# EAGLE design CANTensegrityBoard (EAGLE 6.4)

## Sheet 1 of 6
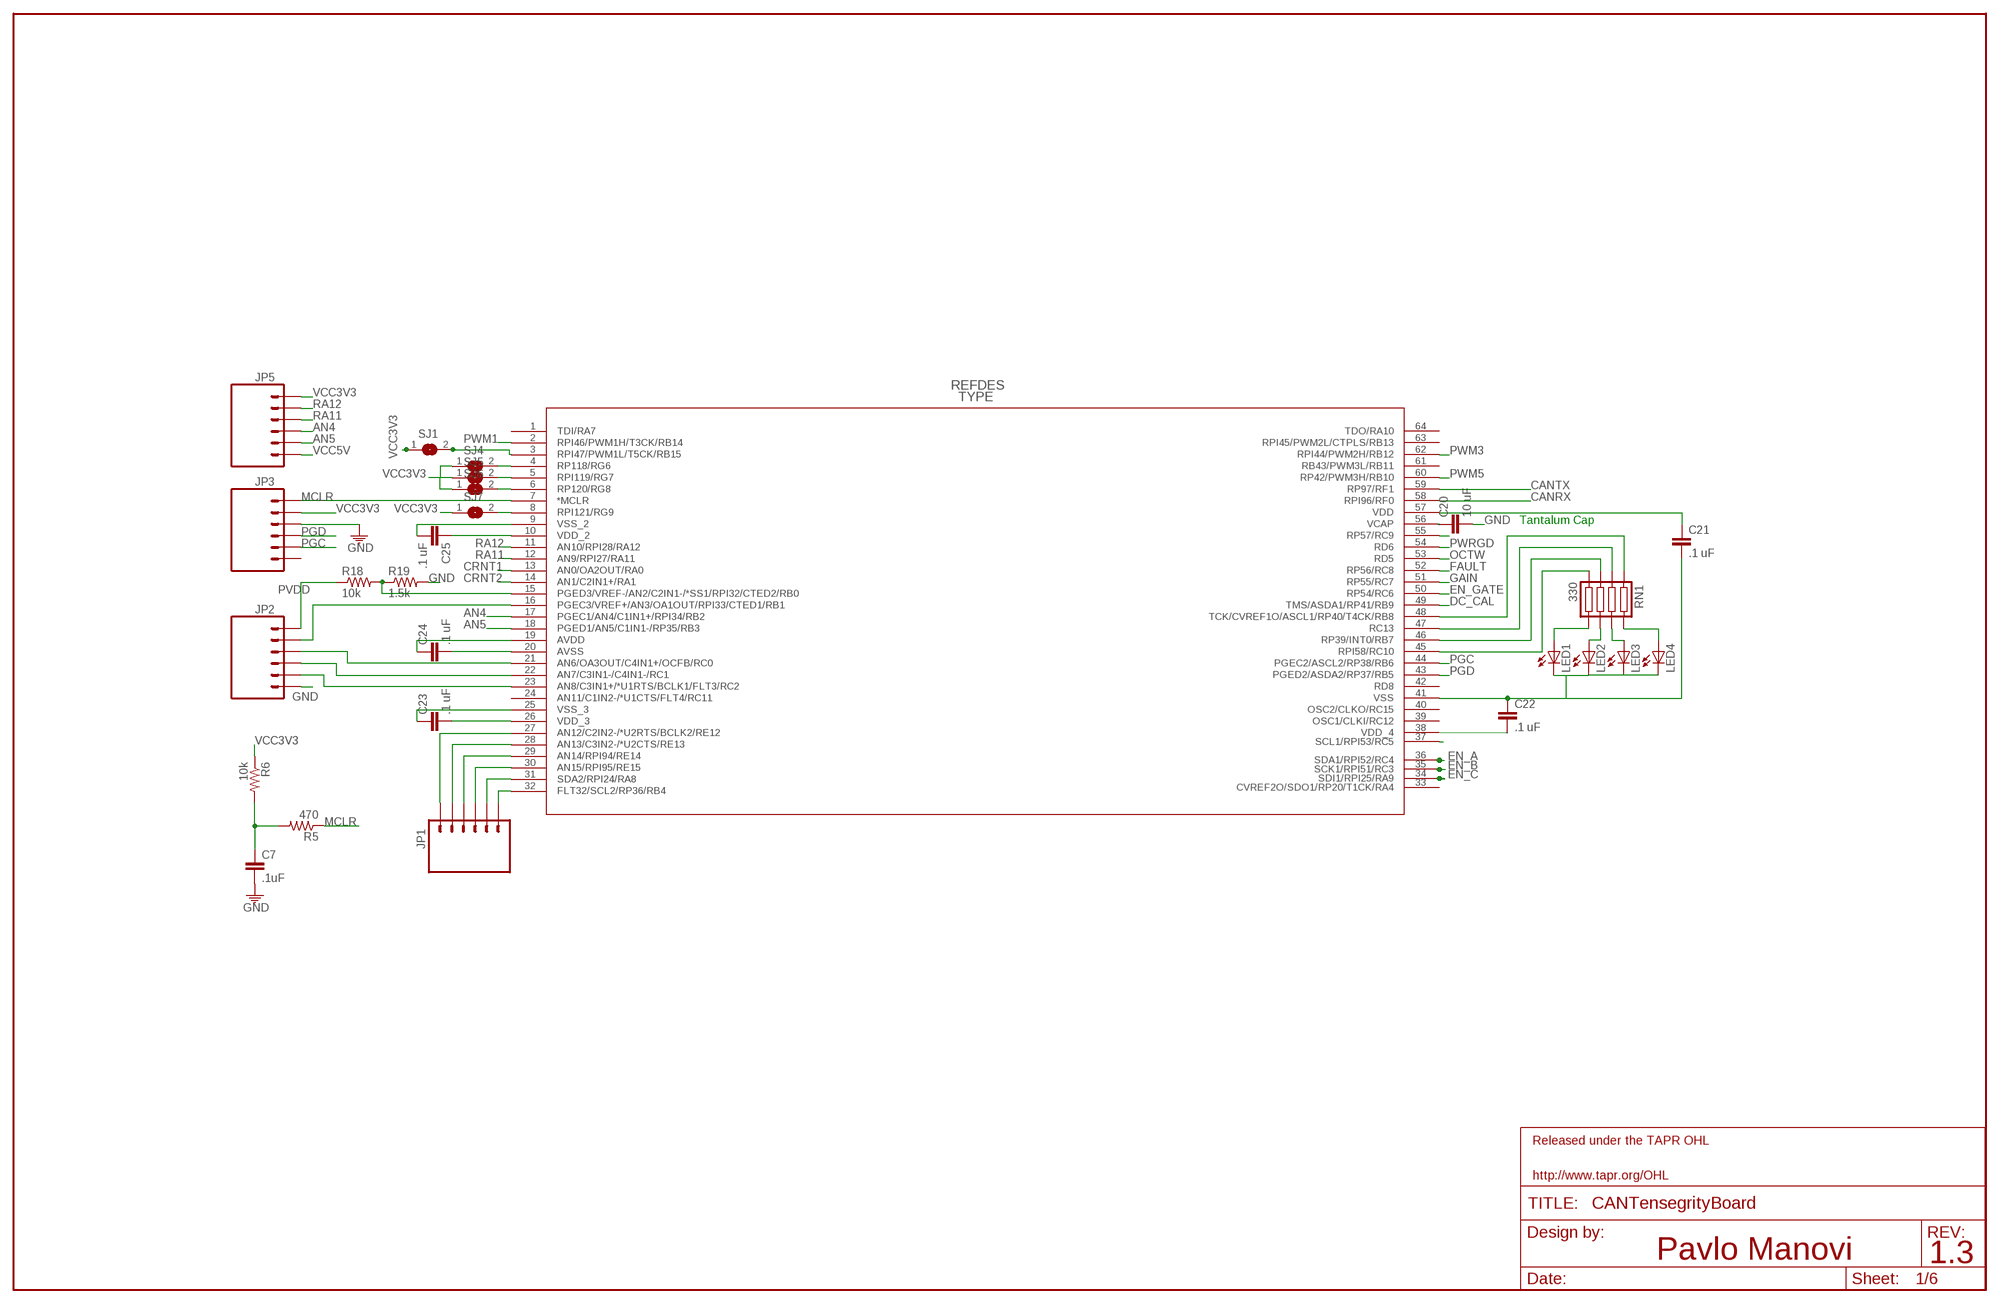
[diagram p0: schematic, sheet 1]

### Parts
C7  .1uF  CAP0805  [0805]
C20  10 uF  CAP1206  [1206]
C21  .1 uF  CAP0805  [0805]
C22  .1 uF  CAP0805  [0805]
C23  .1 uF  CAP0805  [0805]
C24  .1 uF  CAP0805  [0805]
C25  .1 uF  CAP0805  [0805]
JP1  M06SIP  [1X06]
JP2  M06SIP  [1X06]
JP3  M06LOCK  [1X06_LOCK]
JP5  M06LOCK  [1X06_LOCK]
LED1  LED0805  [LED-0805]
LED2  LED0805  [LED-0805]
LED3  LED0805  [LED-0805]
LED4  LED0805  [LED-0805]
R5  470  RESISTOR0805-RES  [0805]
R6  10k  RESISTOR0805-RES  [0805]
R18  10k  RESISTOR0805-RES  [0805]
R19  1.5k  RESISTOR0805-RES  [0805]
RN1  330  RESISTOR_ARRAY-4  [EXB-38V271JV]
SJ1  SJ  [SJ]
SJ4  SJ  [SJ]
SJ5  SJ  [SJ]
SJ6  SJ  [SJ]
SJ7  SJ  [SJ]
U$1  DSPIC33EP128MC502-I/SS  DSPIC33EP256MC50  [QFP64-10X10MC]

### Nets
AN4: JP5.4 U$1.17(PGEC1/AN4/C1IN1+/RPI34/RB2)
AN5: JP5.5 U$1.18(PGED1/AN5/C1IN1-/RP35/RB3)
CANRX: U$1.58(RPI96/RF0) ; also sheet 4
CANTX: U$1.59(RP97/RF1) ; also sheet 4
CRNT1: U$1.13(AN0/OA2OUT/RA0) ; also sheet 2
CRNT2: U$1.14(AN1/C2IN1+/RA1) ; also sheet 2
DC_CAL: U$1.49(TMS/ASDA1/RP41/RB9) ; also sheet 2
EN_A: U$1.36(SDA1/RPI52/RC4) ; also sheet 6
EN_B: U$1.35(SCK1/RPI51/RC3) ; also sheet 6
EN_C: U$1.34(SDI1/RPI25/RA9) ; also sheet 6
EN_GATE: U$1.50(RP54/RC6) ; also sheet 2
FAULT: U$1.52(RP56/RC8) ; also sheet 2
GAIN: U$1.51(RP55/RC7) ; also sheet 2
GND [Power]: C7.2 C20.2 C21.2 C22.1 JP2.6 JP3.3 LED1.2(C) LED2.2(C) LED3.2(C) LED4.2(C) R19.2 U$1.41(VSS) ; also sheet 2,3,4,5,6
MCLR: JP3.1 R5.1 U$1.7(*MCLR)
N$2: C7.1 R5.2 R6.2
N$11: SJ1.2 U$1.3(RPI47/PWM1L/T5CK/RB15)
N$25: R18.2 R19.1 U$1.15(PGED3/VREF-/AN2/C2IN1-/*SS1/RPI32/CTED2/RB0)
N$26: U$1.37(SCL1/RPI53/RC5)
N$27: SJ4.2 U$1.4(RP118/RG6)
N$28: SJ5.2 U$1.5(RPI119/RG7)
N$29: SJ6.2 U$1.6(RP120/RG8)
N$30: SJ7.2 U$1.8(RPI121/RG9)
N$31: C20.1 U$1.56(VCAP)
N$32: C21.1 U$1.57(VDD)
N$33: RN1.P$1 U$1.48(TCK/CVREF1O/ASCL1/RP40/T4CK/RB8)
N$34: C22.2 U$1.38(VDD_4)
N$35: C25.1 U$1.10(VDD_2)
N$36: C25.2 U$1.9(VSS_2)
N$37: C24.2 U$1.20(AVSS)
N$38: C24.1 U$1.19(AVDD)
N$39: C23.2 U$1.26(VDD_3)
N$40: C23.1 U$1.25(VSS_3)
N$41: RN1.P$2 U$1.47(RC13)
N$42: RN1.P$3 U$1.46(RP39/INT0/RB7)
N$43: RN1.P$4 U$1.45(RPI58/RC10)
N$44: LED1.1(A) RN1.P$5
N$45: LED2.1(A) RN1.P$6
N$46: LED3.1(A) RN1.P$7
N$47: LED4.1(A) RN1.P$8
N$48: JP1.6 U$1.32(FLT32/SCL2/RP36/RB4)
N$49: JP1.5 U$1.31(SDA2/RPI24/RA8)
N$50: JP1.4 U$1.30(AN15/RPI95/RE15)
N$51: JP1.3 U$1.29(AN14/RPI94/RE14)
N$52: JP1.2 U$1.28(AN13/C3IN2-/*U2CTS/RE13)
N$53: JP1.1 U$1.27(AN12/C2IN2-/*U2RTS/BCLK2/RE12)
N$55: JP2.2 U$1.16(PGEC3/VREF+/AN3/OA1OUT/RPI33/CTED1/RB1)
N$56: JP2.3 U$1.21(AN6/OA3OUT/C4IN1+/OCFB/RC0)
N$57: JP2.4 U$1.22(AN7/C3IN1-/C4IN1-/RC1)
N$58: JP2.5 U$1.23(AN8/C3IN1+/*U1RTS/BCLK1/FLT3/RC2)
OCTW: U$1.53(RD5) ; also sheet 2
PGC: JP3.5 U$1.44(PGEC2/ASCL2/RP38/RB6)
PGD [small]: JP3.4 U$1.43(PGED2/ASDA2/RP37/RB5)
PVDD [Power]: JP2.1 R18.1 ; also sheet 2,3
PWM1: U$1.2(RPI46/PWM1H/T3CK/RB14) ; also sheet 2
PWM3: U$1.62(RPI44/PWM2H/RB12) ; also sheet 2
PWM5: U$1.60(RP42/PWM3H/RB10) ; also sheet 2
PWRGD: U$1.54(RD6) ; also sheet 2
RA11: JP5.3 U$1.12(AN9/RPI27/RA11)
RA12: JP5.2 U$1.11(AN10/RPI28/RA12)
RC9: U$1.55(RP57/RC9)
VCC3V3 [Power]: JP3.2 JP5.1 R6.1 SJ1.1 SJ4.1 SJ5.1 SJ6.1 SJ7.1 ; also sheet 2,4,5,6
VCC5V: JP5.6 ; also sheet 5
Unconnected: JP3.6 U$1.1(TDI/RA7) U$1.24(AN11/C1IN2-/*U1CTS/FLT4/RC11) U$1.33(CVREF2O/SDO1/RP20/T1CK/RA4) U$1.39(OSC1/CLKI/RC12) U$1.40(OSC2/CLKO/RC15) U$1.42(RD8) U$1.61(RB43/PWM3L/RB11) U$1.63(RPI45/PWM2L/CTPLS/RB13) U$1.64(TDO/RA10)

### Notes on the sheet
- Tantalum Cap

## Sheet 2 of 6
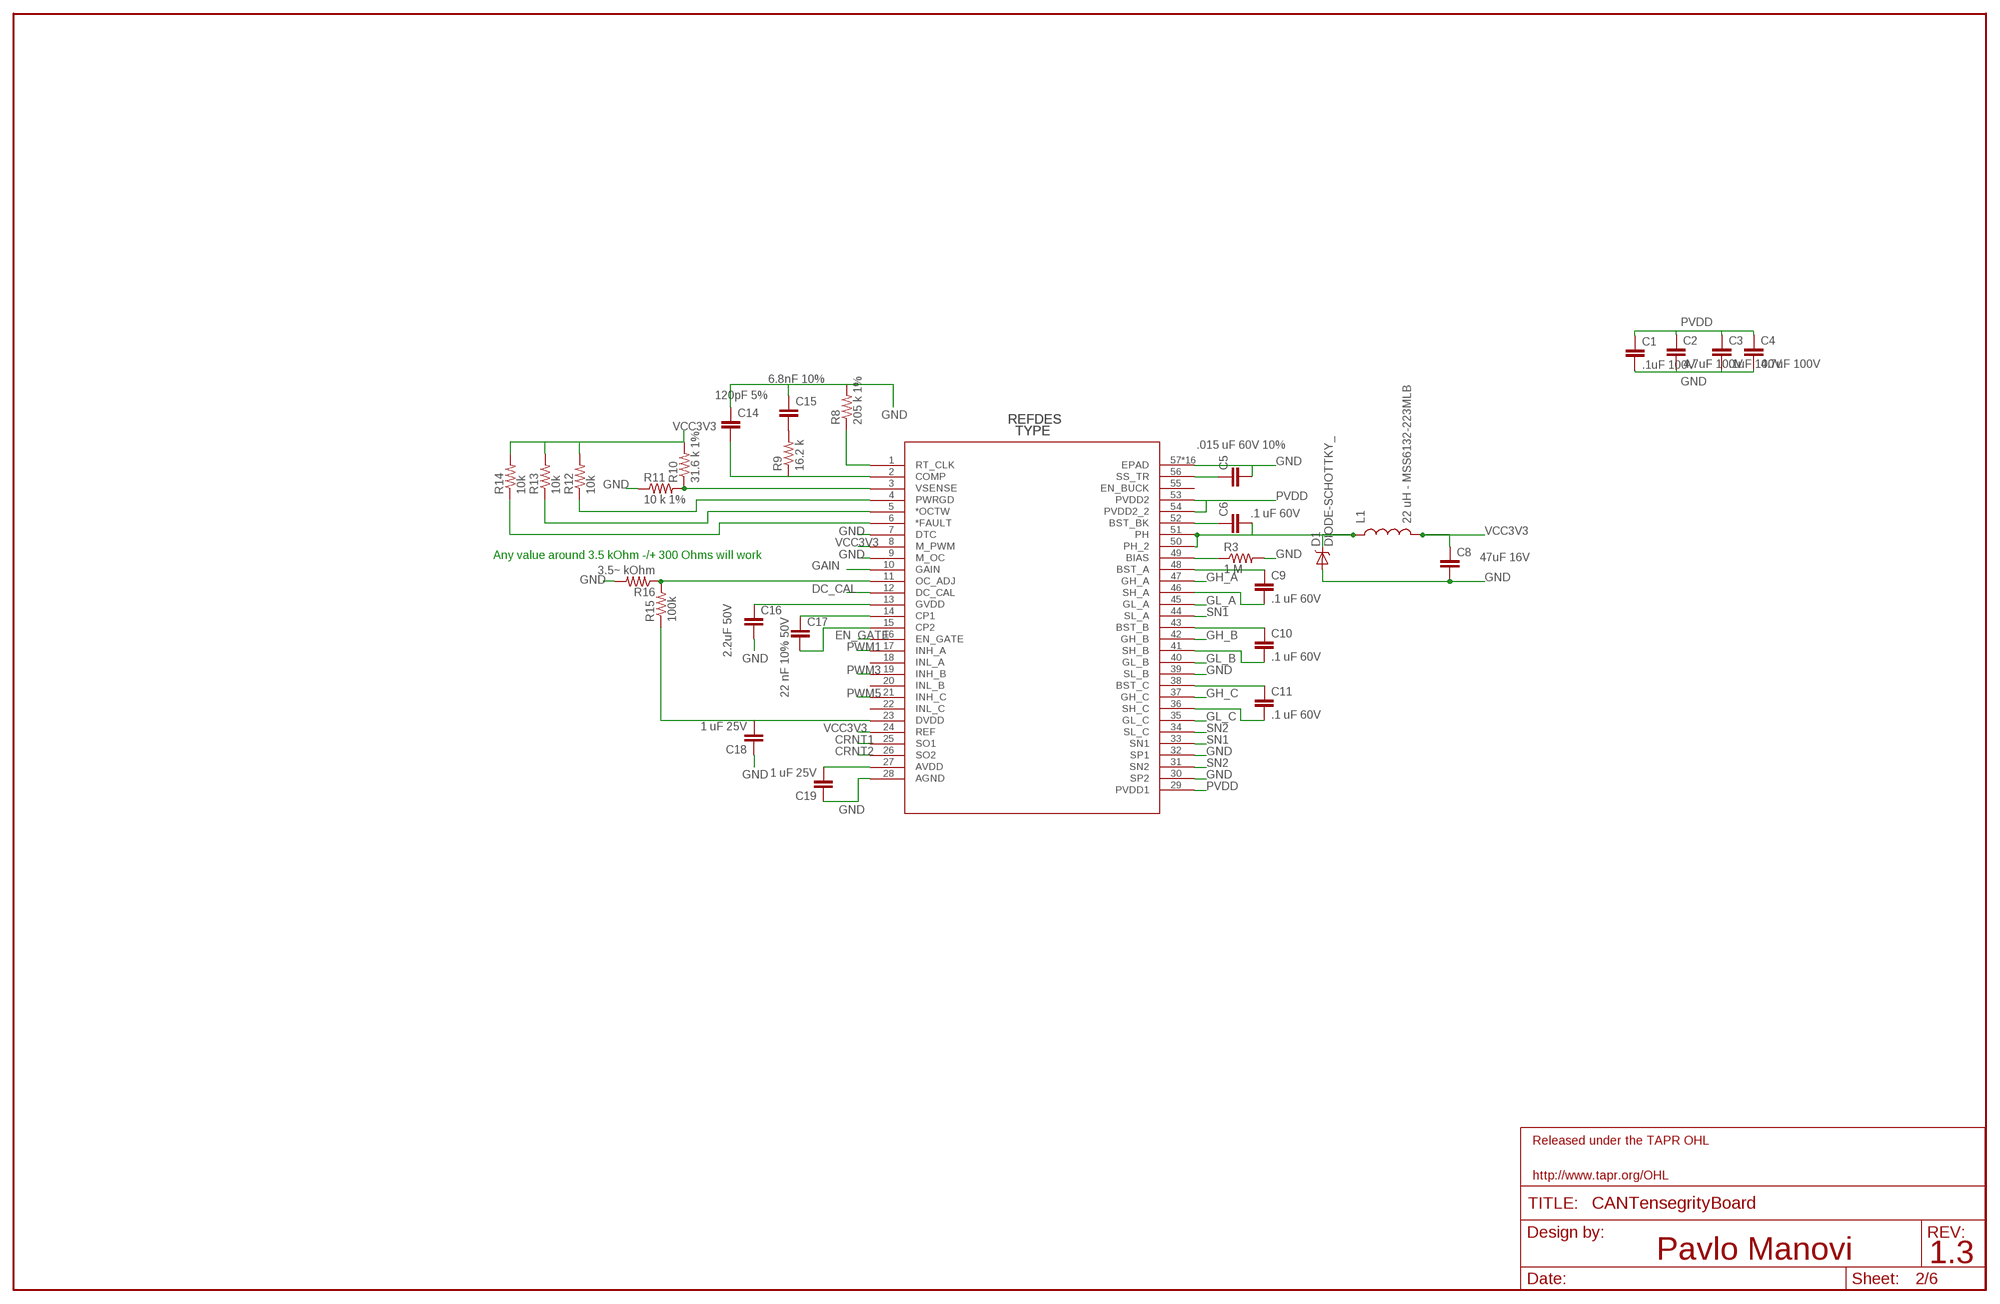
[diagram p1: schematic, sheet 2]

### Parts
C1  .1uF 100V  CAP0805  [0805]
C2  4.7uF 100V  CAP1206  [1206]
C3  .1uF 100V  CAP0805  [0805]
C4  4.7uF 100V  CAP1206  [1206]
C5  .015 uF 60V 10%  CAP0805  [0805]
C6  .1 uF 60V  CAP0805  [0805]
C8  47uF 16V  CAP1206  [1206]
C9  .1 uF 60V  CAP0805  [0805]
C10  .1 uF 60V  CAP0805  [0805]
C11  .1 uF 60V  CAP0805  [0805]
C14  120pF 5%  CAP0805  [0805]
C15  6.8nF 10%  CAP0805  [0805]
C16  2.2uF 50V  CAP1206  [1206]
C17  22 nF 10% 50V  CAP0805  [0805]
C18  1 uF 25V  CAP0805  [0805]
C19  1 uF 25V  CAP0805  [0805]
D1  DIODE-SCHOTTKY_  [SMA-DIODE]
L1  22 uH - MSS6132-223MLB  INDUCTOR  [MSS6132]
R3  1 M  RESISTOR0805-RES  [0805]
R8  205 k 1%  RESISTOR0805-RES  [0805]
R9  16.2 k  RESISTOR0805-RES  [0805]
R10  31.6 k 1%  RESISTOR0805-RES  [0805]
R11  10 k 1%  RESISTOR0805-RES  [0805]
R12  10k  RESISTOR0805-RES  [0805]
R13  10k  RESISTOR0805-RES  [0805]
R14  10k  RESISTOR0805-RES  [0805]
R15  100k  RESISTOR0805-RES  [0805]
R16  3.5~ kOhm  RESISTOR0805-RES  [0805]
U$2  DRV8302  [DCA56_6P35X3P600]

### Nets
CRNT1: U$2.25(SO1) ; also sheet 1
CRNT2: U$2.26(SO2) ; also sheet 1
DC_CAL: U$2.12(DC_CAL) ; also sheet 1
EN_GATE: U$2.16(EN_GATE) ; also sheet 1
FAULT: R14.1 U$2.6(*FAULT) ; also sheet 1
GAIN: U$2.10(GAIN) ; also sheet 1
GH_A: U$2.47(GH_A) ; also sheet 3
GH_B: U$2.42(GH_B) ; also sheet 3
GH_C: U$2.37(GH_C) ; also sheet 3
GL_A: U$2.45(GL_A) ; also sheet 3
GL_B: U$2.40(GL_B) ; also sheet 3
GL_C: U$2.35(GL_C) ; also sheet 3
GND [Power]: C1.2 C2.2 C3.2 C4.2 C5.2 C8.2 C14.1 C15.1 C16.2 C18.1 C19.1 D1.A R3.2 R8.2 R11.1 R16.2 U$2.7(DTC) U$2.9(M_OC) U$2.28(AGND) U$2.30(SP2) U$2.32(SP1) U$2.39(SL_B) U$2.57(EPAD) U$2.P$1(EPAD) U$2.P$2(EPAD) U$2.P$3(EPAD) U$2.P$4(EPAD) U$2.P$5(EPAD) U$2.P$6(EPAD) U$2.P$7(EPAD) U$2.P$8(EPAD) U$2.P$9(EPAD) U$2.P$10(EPAD) U$2.P$11(EPAD) U$2.P$12(EPAD) U$2.P$13(EPAD) U$2.P$14(EPAD) U$2.P$15(EPAD) ; also sheet 1,3,4,5,6
N$1: C5.1 U$2.56(SS_TR)
N$4: C6.1 U$2.52(BST_BK)
N$7: R3.1 U$2.49(BIAS)
N$8: C9.1 U$2.48(BST_A)
N$9: C10.1 U$2.43(BST_B)
N$10: C11.1 U$2.38(BST_C)
N$14: R8.1 U$2.1(RT_CLK)
N$15: C15.2 R9.2
N$16: C14.2 R9.1 U$2.2(COMP)
N$17: R10.1 R11.2 U$2.3(VSENSE)
N$18: C16.1 U$2.13(GVDD)
N$19: C17.1 U$2.14(CP1)
N$20: C17.2 U$2.15(CP2)
N$21: C18.2 R15.1 U$2.23(DVDD)
N$22: C19.2 U$2.27(AVDD)
N$24: R15.2 R16.1 U$2.11(OC_ADJ)
OCTW: R13.1 U$2.5(*OCTW) ; also sheet 1
OUT_U: C9.2 U$2.46(SH_A) ; also sheet 3
OUT_V: C10.2 U$2.41(SH_B) ; also sheet 3
OUT_W: C11.2 U$2.36(SH_C) ; also sheet 3
PH1: C6.2 D1.C L1.P$1 U$2.51(PH)
PVDD [Power]: C1.1 C2.1 C3.1 C4.1 U$2.29(PVDD1) U$2.53(PVDD2) U$2.54(PVDD2_2) ; also sheet 1,3
PWM1: U$2.17(INH_A) ; also sheet 1
PWM3: U$2.19(INH_B) ; also sheet 1
PWM5: U$2.21(INH_C) ; also sheet 1
PWRGD: R12.1 U$2.4(PWRGD) ; also sheet 1
SN1: U$2.33(SN1) U$2.44(SL_A) ; also sheet 3
SN2: U$2.31(SN2) U$2.34(SL_C) ; also sheet 3
VCC3V3 [Power]: C8.1 L1.P$2 R10.2 R12.2 R13.2 R14.2 U$2.8(M_PWM) U$2.24(REF) ; also sheet 1,4,5,6
Unconnected: U$2.18(INL_A) U$2.20(INL_B) U$2.22(INL_C) U$2.50(PH_2) U$2.55(EN_BUCK)

### Notes on the sheet
- Any value around 3.5 kOhm -/+ 300 Ohms will work

## Sheet 3 of 6
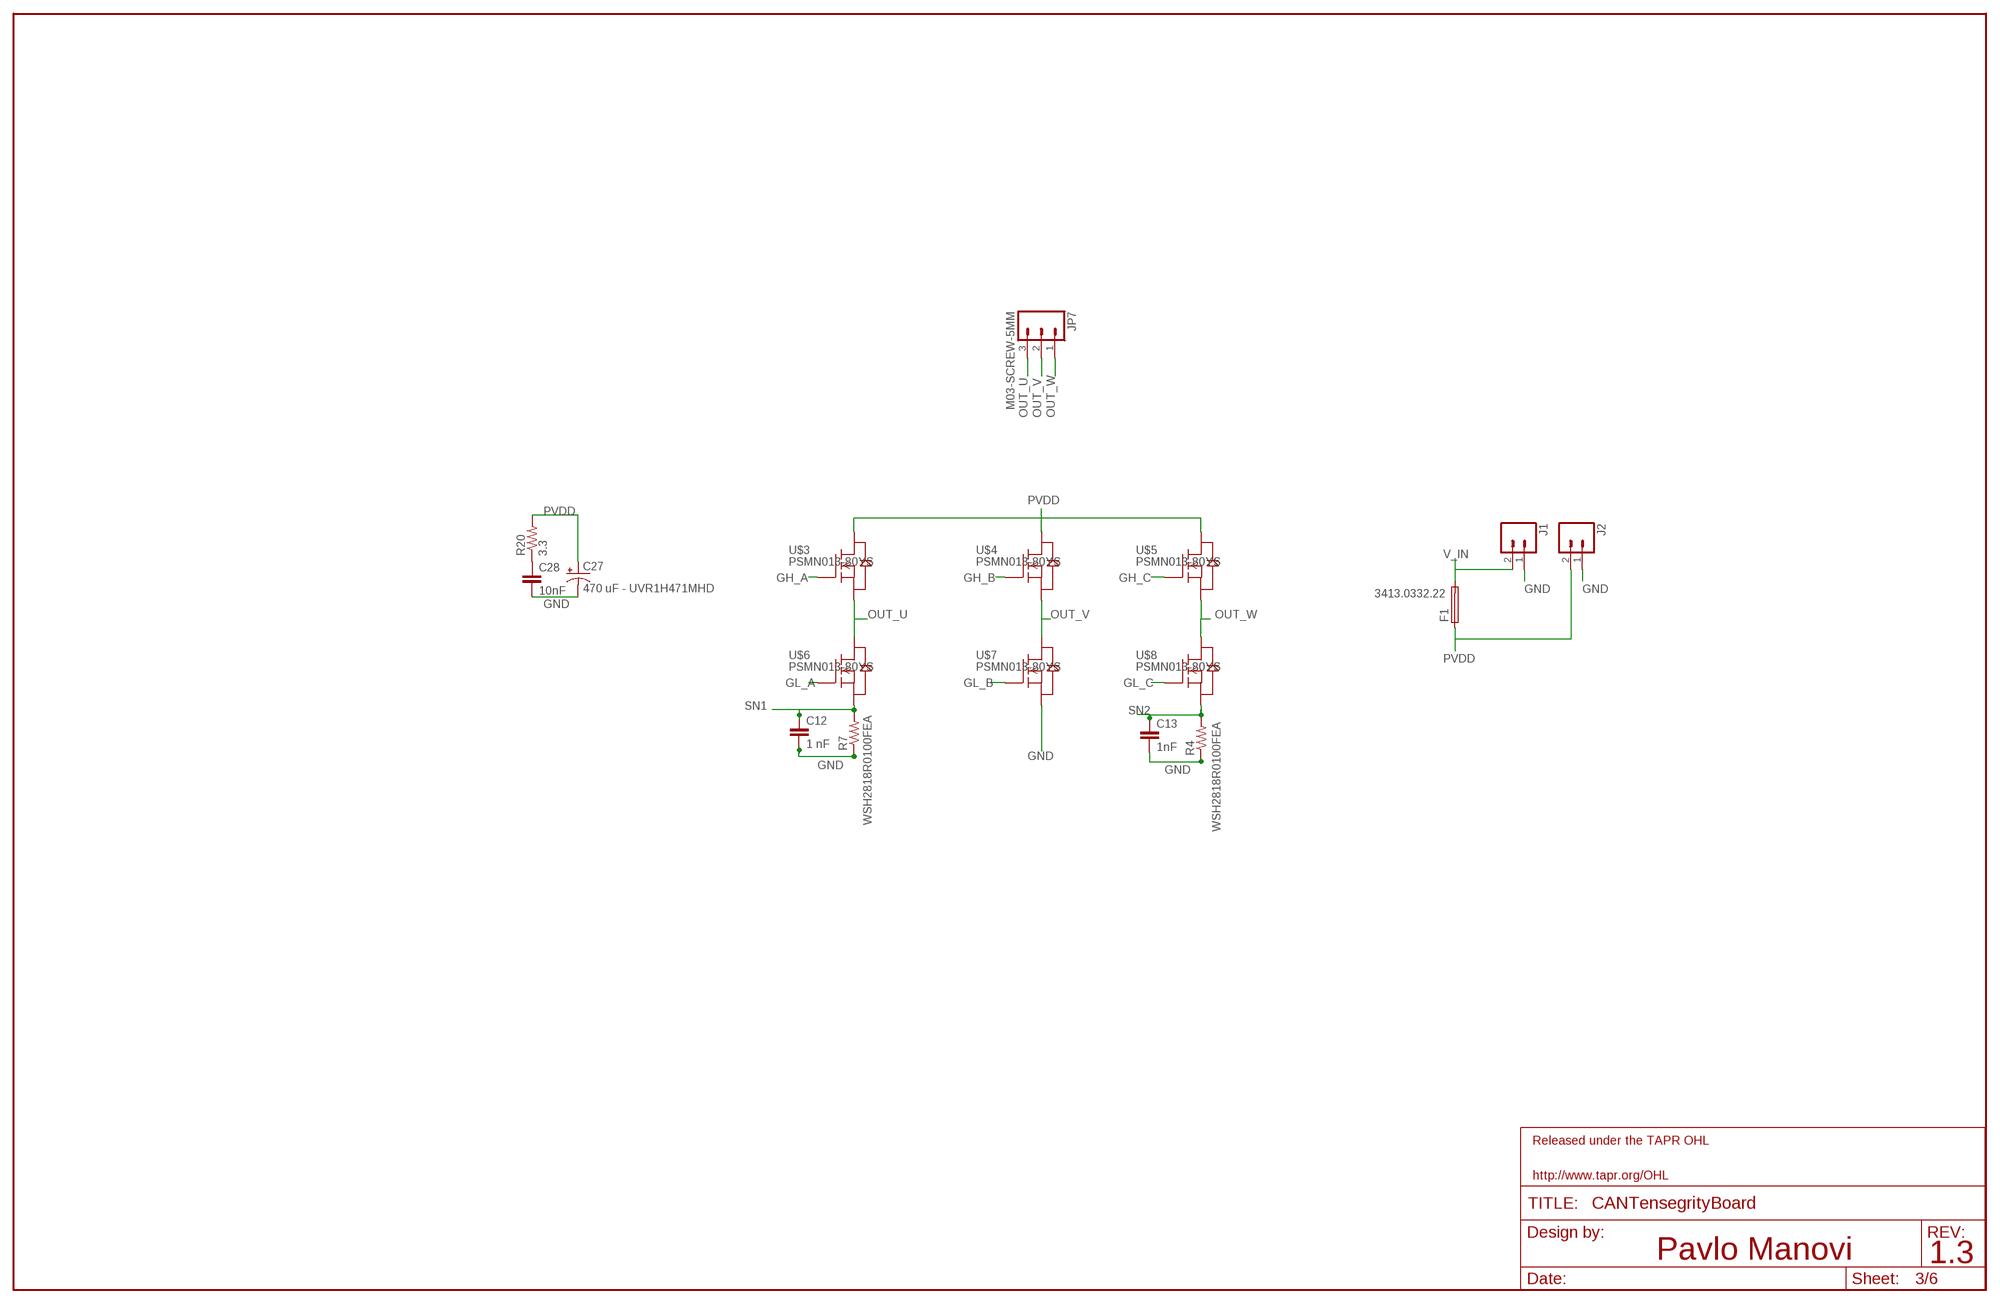
[diagram p2: schematic, sheet 3]

### Parts
C12  1 nF  CAP0805  [0805]
C13  1nF  CAP0805  [0805]
C27  470 uF - UVR1H471MHD  CAP_POLPTH4  [CPOL-RADIAL-1000UF-25V]
C28  10nF  CAP0805  [0805]
F1  3413.0332.22  TE5  [LED-1206]
J1  M02PTH4  [1X02_XTRA_BIG]
J2  M02PTH4  [1X02_XTRA_BIG]
JP7  M03-SCREW-5MM  [SCREWTERMINAL-5MM-3]
R4  WSH2818R0100FEA  RESISTOR  [SMT-REF]
R7  WSH2818R0100FEA  RESISTOR  [SMT-REF]
R20  3.3  RESISTOR0805-RES  [0805]
U$3  PSMN013-80YS  [TO127P600X120-5N]
U$4  PSMN013-80YS  [TO127P600X120-5N]
U$5  PSMN013-80YS  [TO127P600X120-5N]
U$6  PSMN013-80YS  [TO127P600X120-5N]
U$7  PSMN013-80YS  [TO127P600X120-5N]
U$8  PSMN013-80YS  [TO127P600X120-5N]

### Nets
GH_A: U$3.4(G) ; also sheet 2
GH_B: U$4.4(G) ; also sheet 2
GH_C: U$5.4(G) ; also sheet 2
GL_A: U$6.4(G) ; also sheet 2
GL_B: U$7.4(G) ; also sheet 2
GL_C: U$8.4(G) ; also sheet 2
GND [Power]: C12.2 C13.2 C27.2(-) C28.2 J1.1 J2.1 R4.1 R7.1 U$7.1(S) U$7.2(S) U$7.3(S) ; also sheet 1,2,4,5,6
N$6: C28.1 R20.1
OUT_U: JP7.3 U$3.1(S) U$3.2(S) U$3.3(S) U$6.5(D) U$6.P$1(D) U$6.P$2(D) U$6.P$3(D) U$6.P$4(D) U$6.P$5(D) U$6.P$6(D) U$6.P$7(D) U$6.P$8(D) U$6.P$9(D) ; also sheet 2
OUT_V: JP7.2 U$4.1(S) U$4.2(S) U$4.3(S) U$7.5(D) U$7.P$1(D) U$7.P$2(D) U$7.P$3(D) U$7.P$4(D) U$7.P$5(D) U$7.P$6(D) U$7.P$7(D) U$7.P$8(D) U$7.P$9(D) ; also sheet 2
OUT_W: JP7.1 U$5.1(S) U$5.2(S) U$5.3(S) U$8.5(D) U$8.P$1(D) U$8.P$2(D) U$8.P$3(D) U$8.P$4(D) U$8.P$5(D) U$8.P$6(D) U$8.P$7(D) U$8.P$8(D) U$8.P$9(D) ; also sheet 2
PVDD [Power]: C27.1(+) F1.A J2.2 R20.2 U$3.5(D) U$3.P$1(D) U$3.P$2(D) U$3.P$3(D) U$3.P$4(D) U$3.P$5(D) U$3.P$6(D) U$3.P$7(D) U$3.P$8(D) U$3.P$9(D) U$4.5(D) U$4.P$1(D) U$4.P$2(D) U$4.P$3(D) U$4.P$4(D) U$4.P$5(D) U$4.P$6(D) U$4.P$7(D) U$4.P$8(D) U$4.P$9(D) U$5.5(D) U$5.P$1(D) U$5.P$2(D) U$5.P$3(D) U$5.P$4(D) U$5.P$5(D) U$5.P$6(D) U$5.P$7(D) U$5.P$8(D) U$5.P$9(D) ; also sheet 1,2
SN1: C12.1 R7.2 U$6.1(S) U$6.2(S) U$6.3(S) ; also sheet 2
SN2: C13.1 R4.2 U$8.1(S) U$8.2(S) U$8.3(S) ; also sheet 2
V_IN [Power]: F1.C J1.2

## Sheet 4 of 6
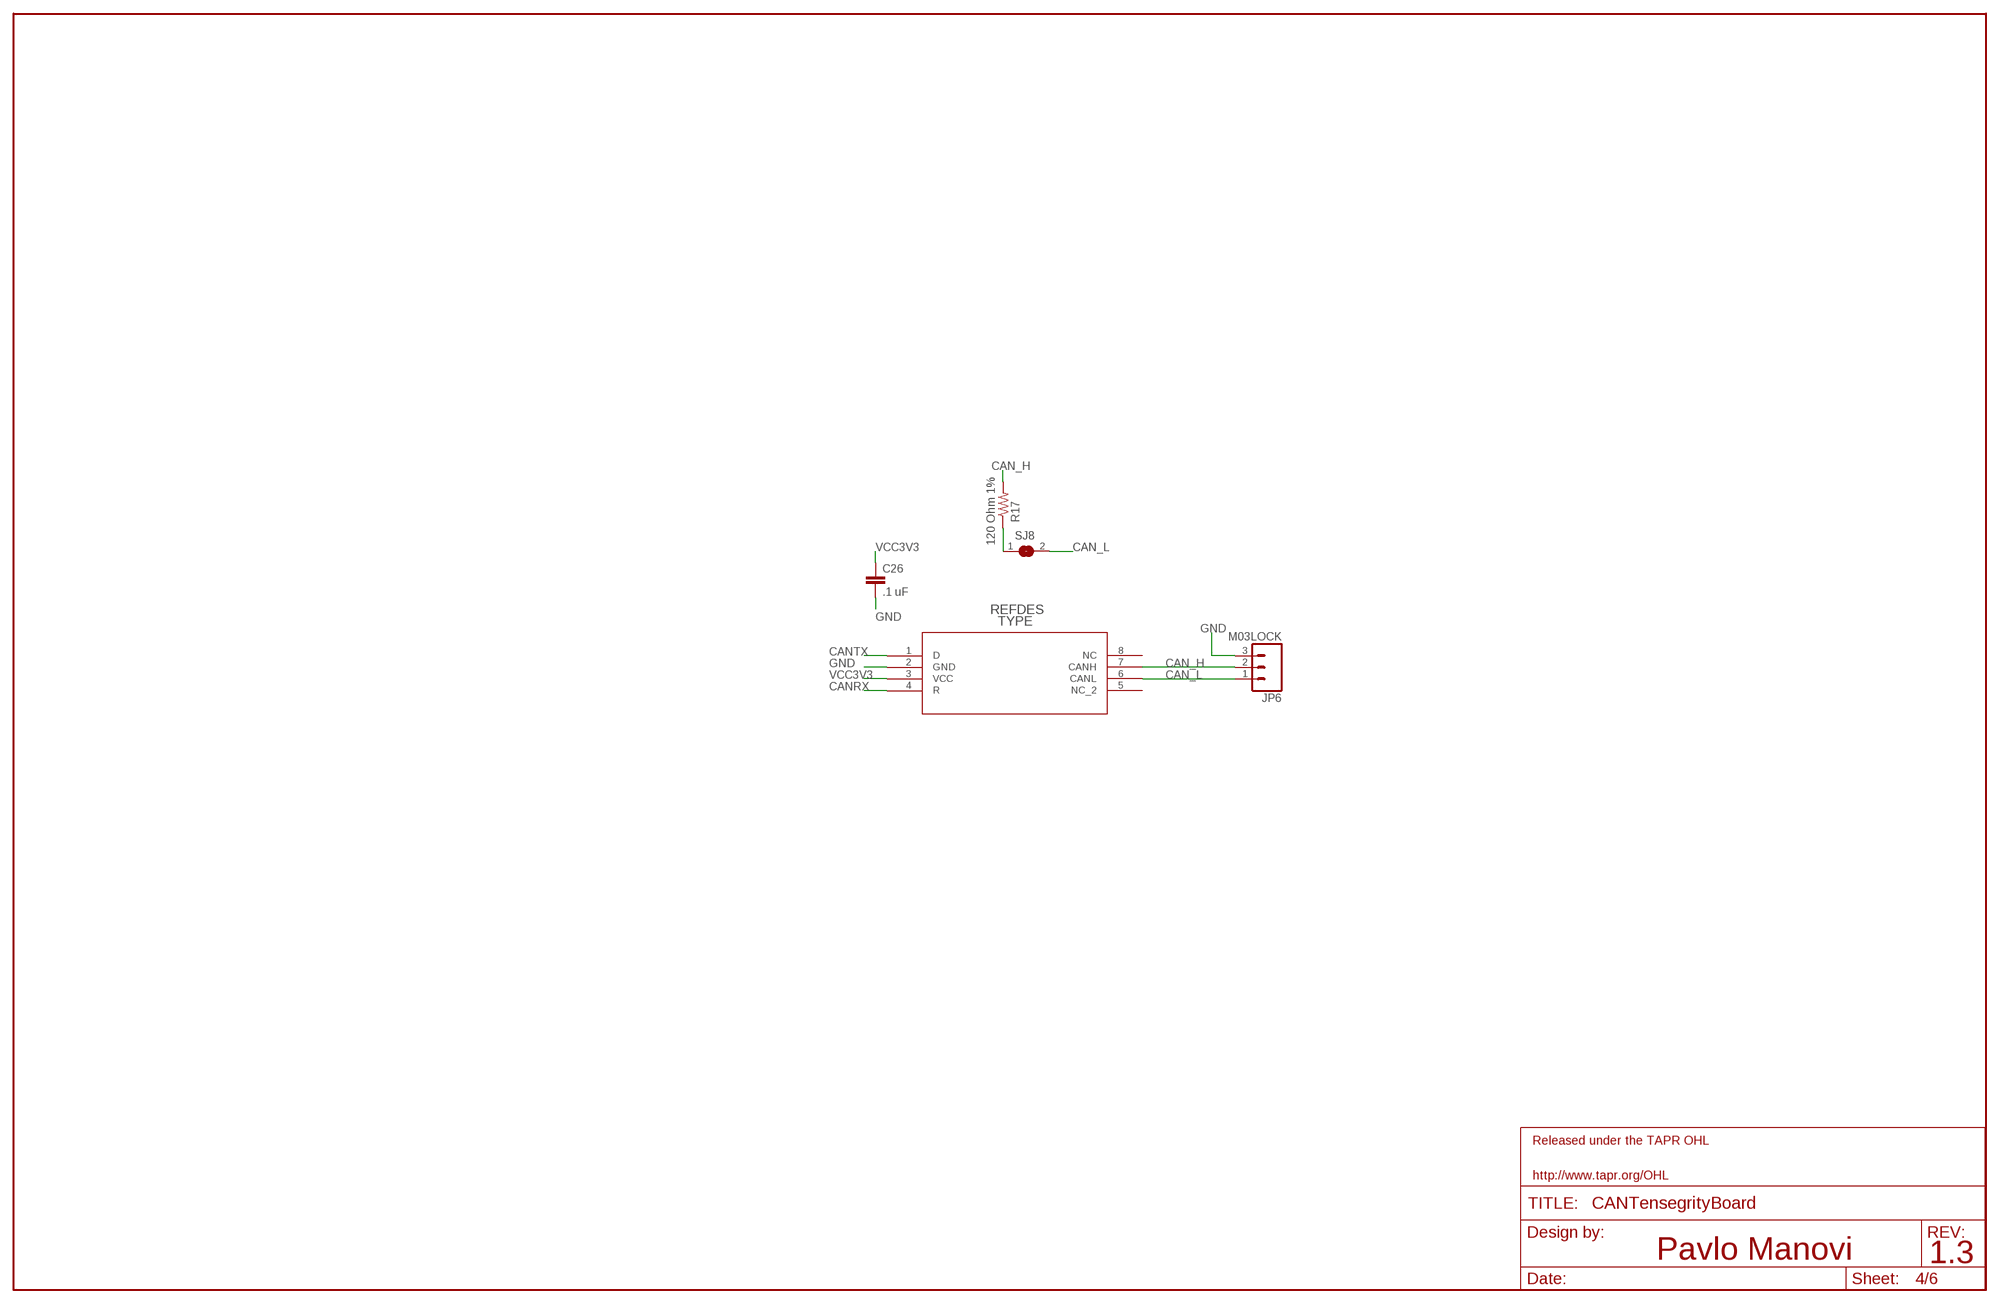
[diagram p3: schematic, sheet 4]

### Parts
C26  .1 uF  CAP0805  [0805]
JP6  M03LOCK  [1X03_LOCK]
R17  120 Ohm 1%  RESISTOR0805-RES  [0805]
SJ8  SJ  [SJ]
U2  SN65HVD232_D_8  [D8]

### Nets
CAN_H: JP6.2 R17.2 U2.7(CANH)
CAN_L: JP6.1 SJ8.2 U2.6(CANL)
CANRX: U2.4(R) ; also sheet 1
CANTX: U2.1(D) ; also sheet 1
GND [Power]: C26.2 JP6.3 U2.2(GND) ; also sheet 1,2,3,5,6
N$64: R17.1 SJ8.1
VCC3V3 [Power]: C26.1 U2.3(VCC) ; also sheet 1,2,5,6
Unconnected: U2.5(NC_2) U2.8(NC)

## Sheet 5 of 6
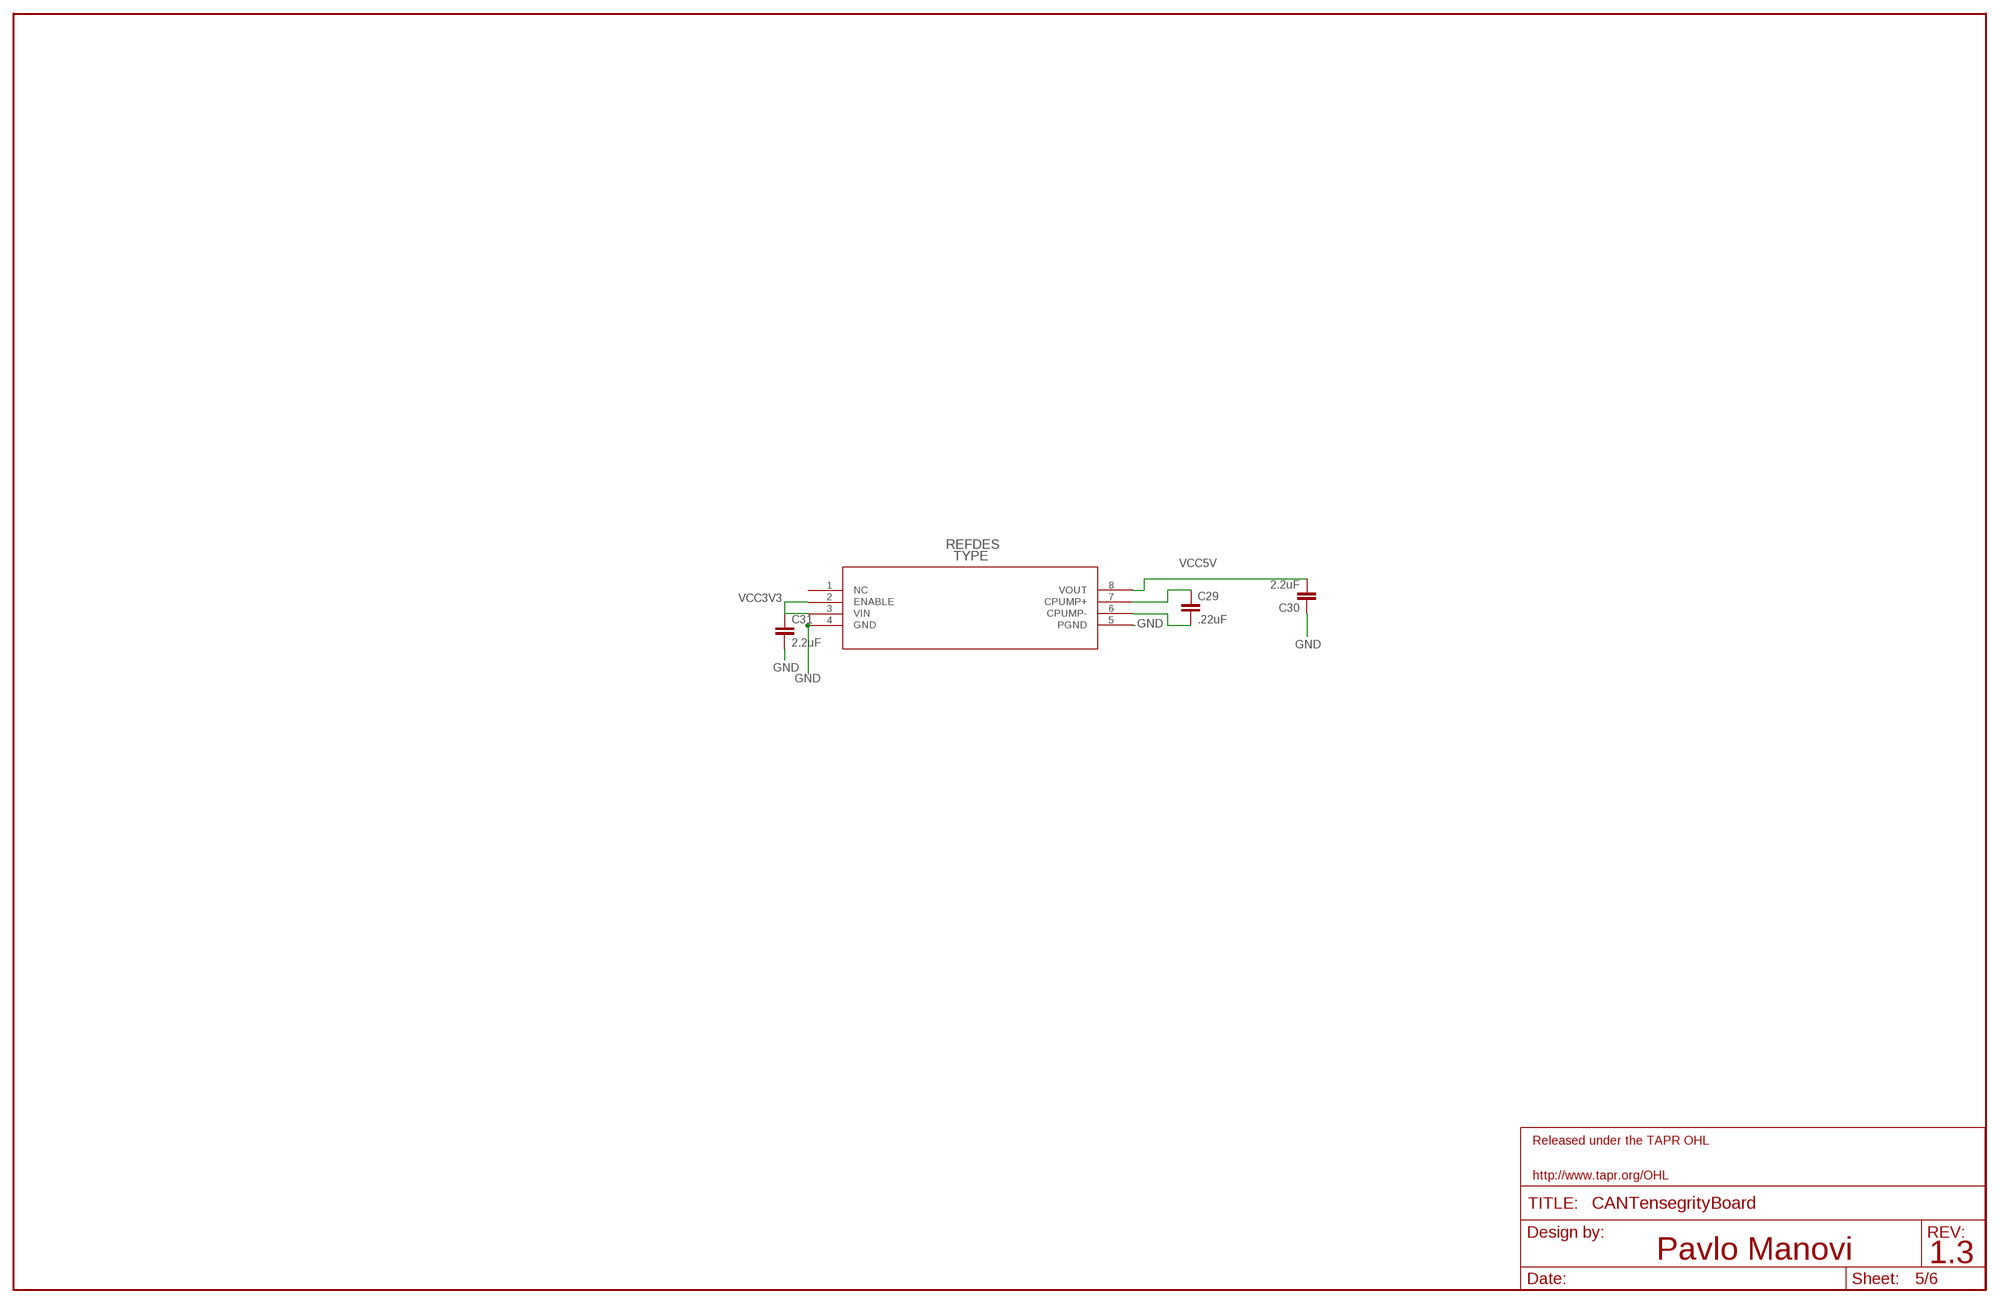
[diagram p4: schematic, sheet 5]

### Parts
C29  .22uF  CAP0805  [0805]
C30  2.2uF  CAP0805  [0805]
C31  2.2uF  CAP0805  [0805]
U1  REG711-5_DGK_8  [DGK8]

### Nets
GND [Power]: C30.1 C31.2 U1.4(GND) U1.5(PGND) ; also sheet 1,2,3,4,6
N$13: C29.2 U1.6(CPUMP-)
N$23: C29.1 U1.7(CPUMP+)
VCC3V3 [Power]: C31.1 U1.2(ENABLE) U1.3(VIN) ; also sheet 1,2,4,6
VCC5V: C30.2 U1.8(VOUT) ; also sheet 1
Unconnected: U1.1(NC)

## Sheet 6 of 6
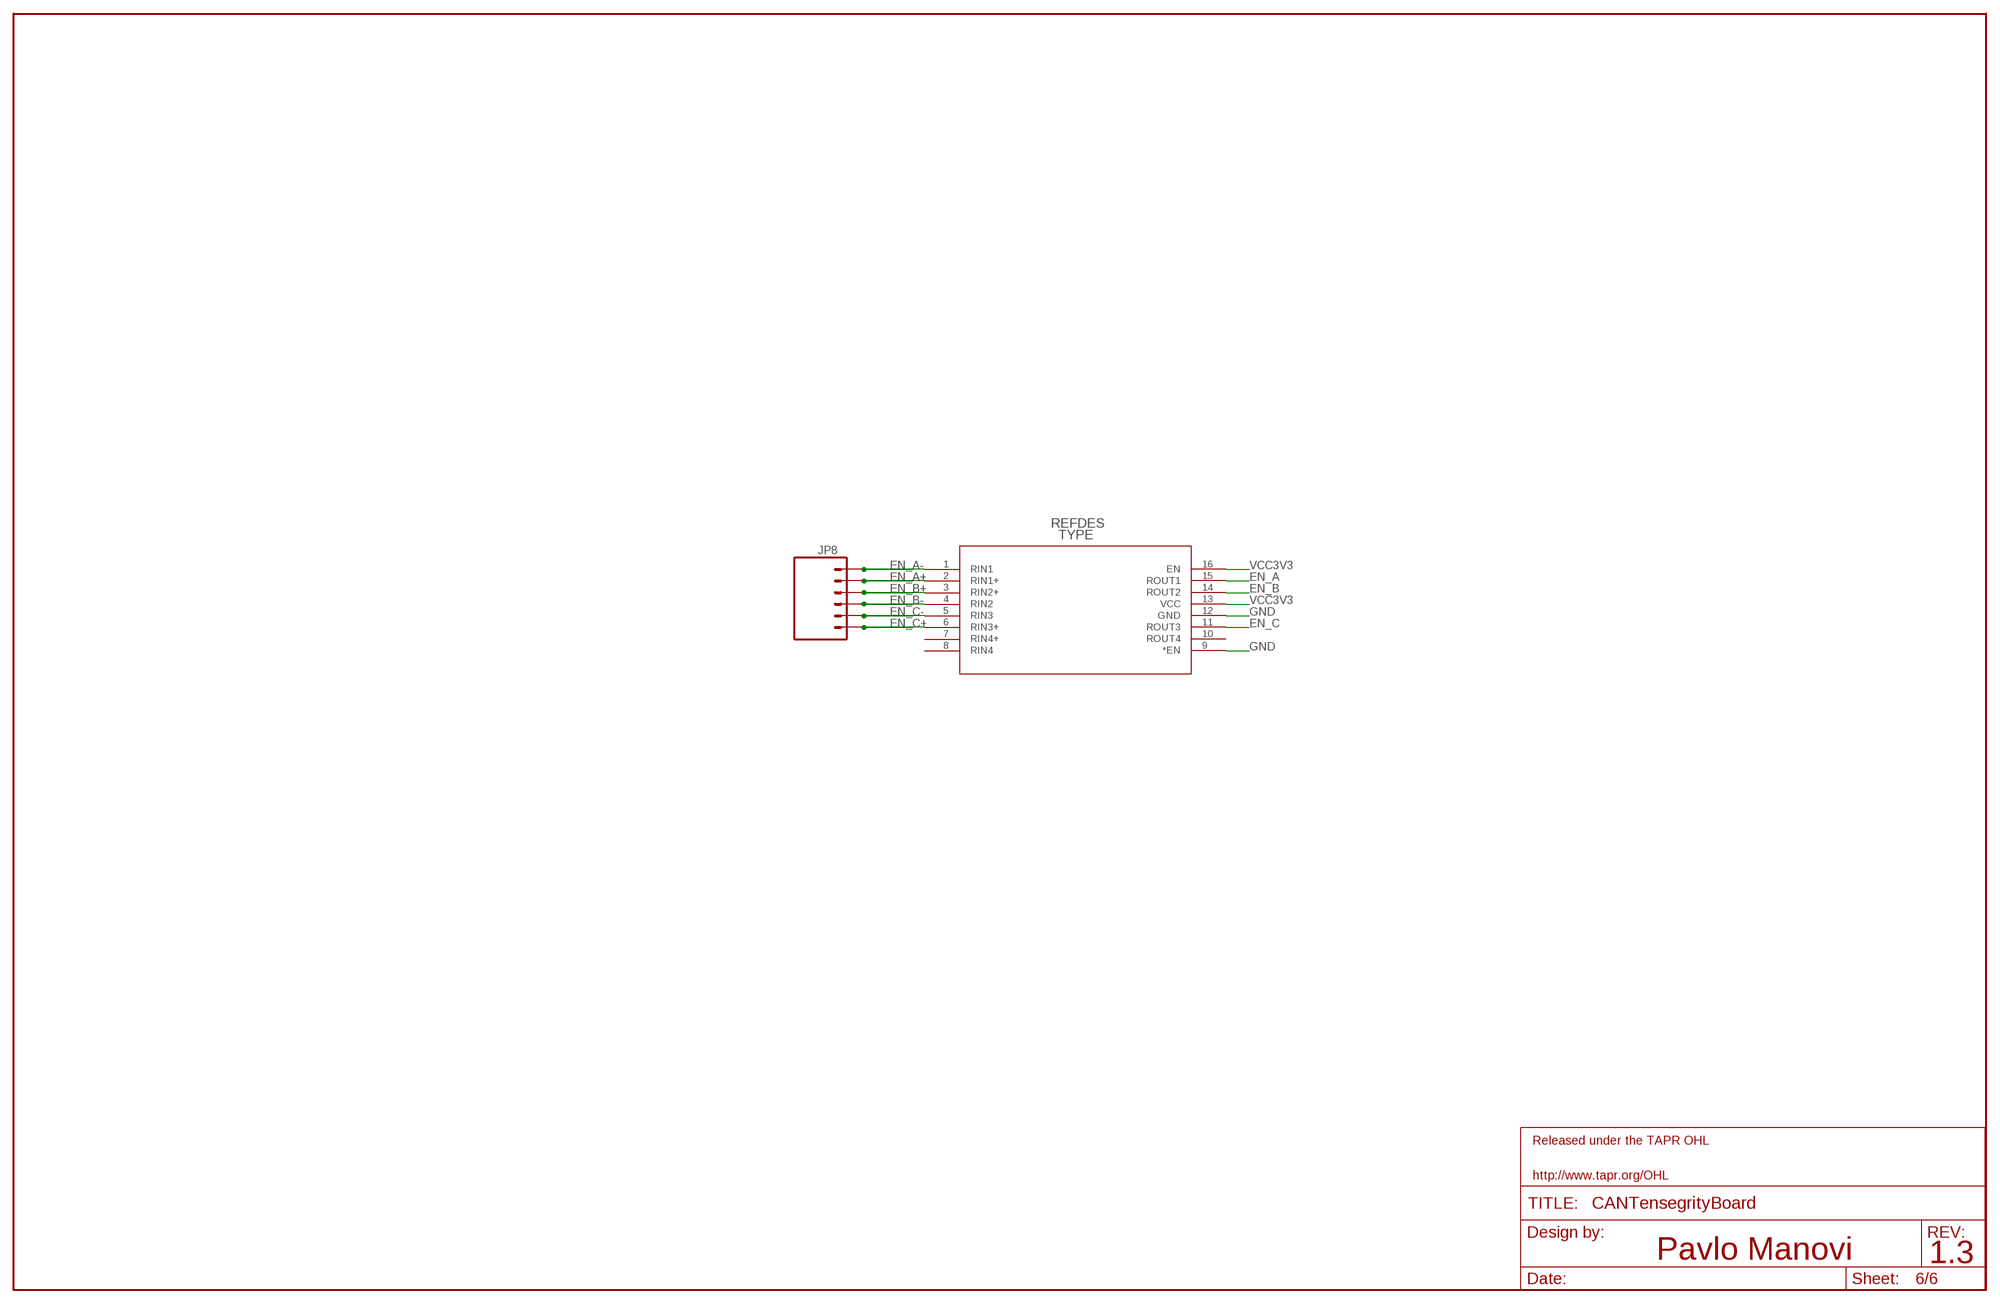
[diagram p5: schematic, sheet 6]

### Parts
JP8  M06SIP_LOCK  [1X06-SIP_LOCK]
U3  SN65LVDT348_PW_1  [PW16]

### Nets
EN_A: U3.15(ROUT1) ; also sheet 1
EN_A+: JP8.2 U3.2(RIN1+)
EN_A-: JP8.1 U3.1(RIN1)
EN_B: U3.14(ROUT2) ; also sheet 1
EN_B+: JP8.3 U3.3(RIN2+)
EN_B-: JP8.4 U3.4(RIN2)
EN_C: U3.11(ROUT3) ; also sheet 1
EN_C+: JP8.6 U3.6(RIN3+)
EN_C-: JP8.5 U3.5(RIN3)
GND [Power]: U3.9(*EN) U3.12(GND) ; also sheet 1,2,3,4,5
VCC3V3 [Power]: U3.13(VCC) U3.16(EN) ; also sheet 1,2,4,5
Unconnected: U3.7(RIN4+) U3.8(RIN4) U3.10(ROUT4)

## Library data of the parts
C1-C26 C28-C31 = ASL:CAP: Capacitor Standard 0603 ceramic capacitor, and 0.1" leaded capacitor.
C27 = ASL:CAP_POL: Capacitor Polarized These are standard SMD and PTH capacitors. Normally 10uF, 47uF, and 100uF in electrolytic and tantalum varieties. Always verify the external diameter of the through hole cap, it varies with capacity, voltage, and manufacturer. The EIA devices should be standard.
D1 = ASL:DIODE-SCHOTTKY
F1 = pavlo:TE5: FUSE Wickmann
J1 J2 = ASL:M02: Header 2 Standard 2-pin 0.1" header. Use with straight break away headers (SKU : PRT-00116), right angle break away headers (PRT-00553), swiss pins (PRT-00743), machine pins (PRT-00117), and female headers (PRT-00115). Molex polarized connector foot print use with SKU : PRT-08233 with associated crimp pins and housings.
JP1 JP2 JP8 = ASL:M06: Header 6 Standard 6-pin 0.1" header. Use with straight break away headers (SKU : PRT-00116), right angle break away headers (PRT-00553), swiss pins (PRT-00743), machine pins (PRT-00117), and female headers (PRT-00115). Molex polarized connector foot print use with SKU : PRT-08094 with associated crimp pins and housings. NOTES ON THE VARIANTS LOCK and LOCK_LONGPADS... This footprint was designed to help hold the alignment of a through-hole component (i.e. 6-pin header) while soldering it into place. You may notice that each hole has been shifted either up or down by 0.005 of an inch from it's more standard position (which is a perfectly straight line). This slight alteration caused the pins (the squares in the middle) to touch the edges of the holes. Because they are alternating, it causes a "brace" to hold the component in place. 0.005 has proven to be the perfect amount of "off-center" position when using our standard breakaway headers. Although looks a little odd when you look at the bare footprint, once you have a header in there, the alteration is very hard to notice. Also, if you push a header all the way into place, it is covered up entirely on the bottom side. This idea of altering the position of holes to aid alignment will be further integrated into the Sparkfun Library for other footprints. It can help hold any component with 3 or more connection pins.
JP3 JP5 = CMPE118lib:M06: Header 6 Standard 6-pin 0.1" header. Use with straight break away headers (SKU : PRT-00116), right angle break away headers (PRT-00553), swiss pins (PRT-00743), machine pins (PRT-00117), and female headers (PRT-00115). Molex polarized connector foot print use with SKU : PRT-08094 with associated crimp pins and housings. NOTES ON THE VARIANTS LOCK and LOCK_LONGPADS... This footprint was designed to help hold the alignment of a through-hole component (i.e. 6-pin header) while soldering it into place. You may notice that each hole has been shifted either up or down by 0.005 of an inch from it's more standard position (which is a perfectly straight line). This slight alteration caused the pins (the squares in the middle) to touch the edges of the holes. Because they are alternating, it causes a "brace" to hold the component in place. 0.005 has proven to be the perfect amount of "off-center" position when using our standard breakaway headers. Although looks a little odd when you look at the bare footprint, once you have a header in there, the alteration is very hard to notice. Also, if you push a header all the way into place, it is covered up entirely on the bottom side. This idea of altering the position of holes to aid alignment will be further integrated into the Sparkfun Library for other footprints. It can help hold any component with 3 or more connection pins.
JP6 = ASL:M03: Header 3 Standard 3-pin 0.1" header. Use with straight break away headers (SKU : PRT-00116), right angle break away headers (PRT-00553), swiss pins (PRT-00743), machine pins (PRT-00117), and female headers (PRT-00115). Molex polarized connector foot print use with SKU : PRT-08232 with associated crimp pins and housings.
JP7 = pavlo:M03: Header 3 Standard 3-pin 0.1" header. Use with straight break away headers (SKU : PRT-00116), right angle break away headers (PRT-00553), swiss pins (PRT-00743), machine pins (PRT-00117), and female headers (PRT-00115). Molex polarized connector foot print use with SKU : PRT-08232 with associated crimp pins and housings.
L1 = pavlo:INDUCTOR: Inductors Basic Inductor/Choke - 0603 and 1206. Footprints are not proven and vary greatly between part numbers.
LED1-LED4 = ASL:LED: LEDs Standard schematic elements and footprints for 5mm, 3mm, 1206, and 0603 sized LEDs. 5mm - Spark Fun Electronics SKU : COM-00529 (and others)
R3 R8-R20 = ASL:RESISTOR: Resistor Basic schematic elements and footprints for 0603, 1206, and PTH resistors.
R4 R7 = pavlo:RESISTOR: Resistor Basic schematic elements and footprints for 0603, 1206, and PTH resistors.
R5 R6 = CMPE118lib:RESISTOR: Resistor Basic schematic elements and footprints for 0603, 1206, and PTH resistors.
RN1 = ASL:RESISTOR_ARRAY-4: Chip Resistor Array 4 Single Resistor Source: http://industrial.panasonic.com/www-data/pdf/AOC0000/AOC0000PE2.pdf; OC_FARNELL: unknown; OC_NEWARK: unknown
SJ1 SJ4-SJ8 = jumper:SJ: SMD solder JUMPER
U1 = pavlo:REG711-5_DGK_8
U2 = pavlo:SN65HVD232_D_8
U3 = pavlo:SN65LVDT348_PW_1
U$1 = pavlo:DSPIC33EP256MC50
U$2 = pavlo:DRV8302
U$3-U$8 = pavlo:PSMN013-80YS

## Net classes
2 small: width 0.254 mm, clearance 0.254 mm to class 1
3 Power: clearance 0.381 mm to class 0

## Board
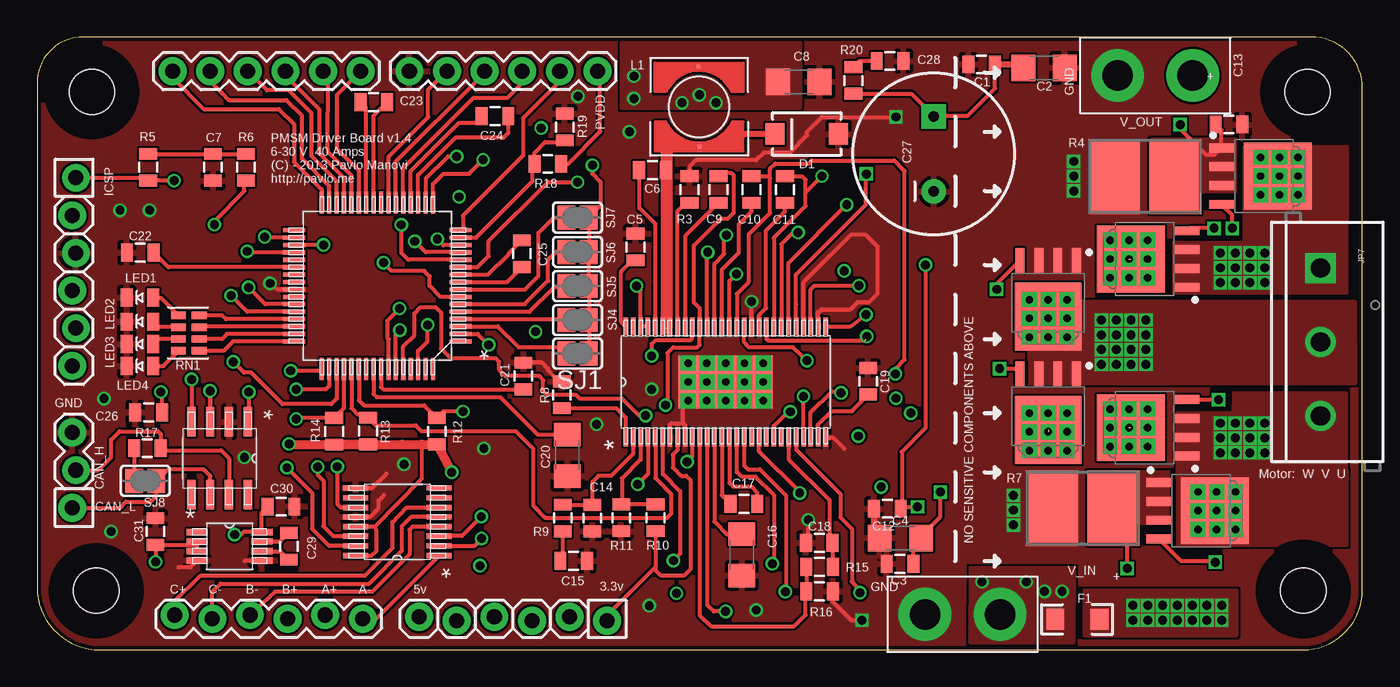
[diagram p6: board, top side]
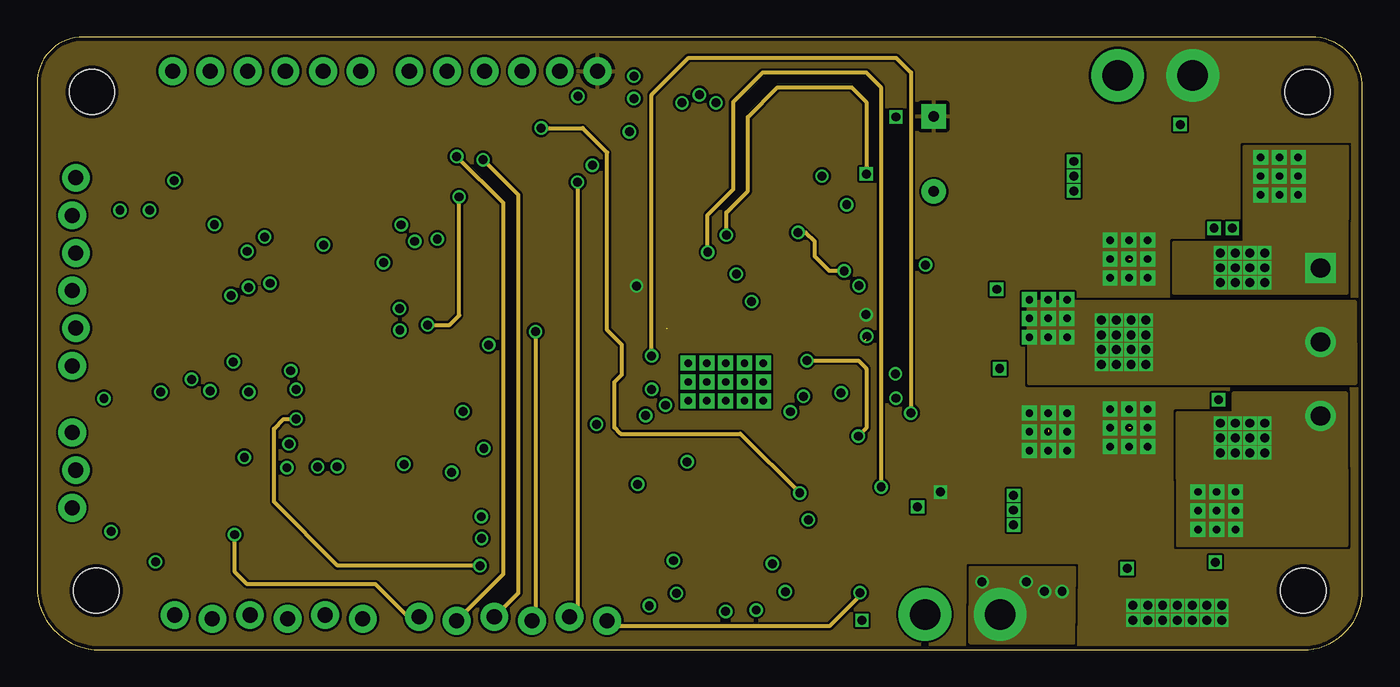
[diagram p7: board, inner layer Route2]
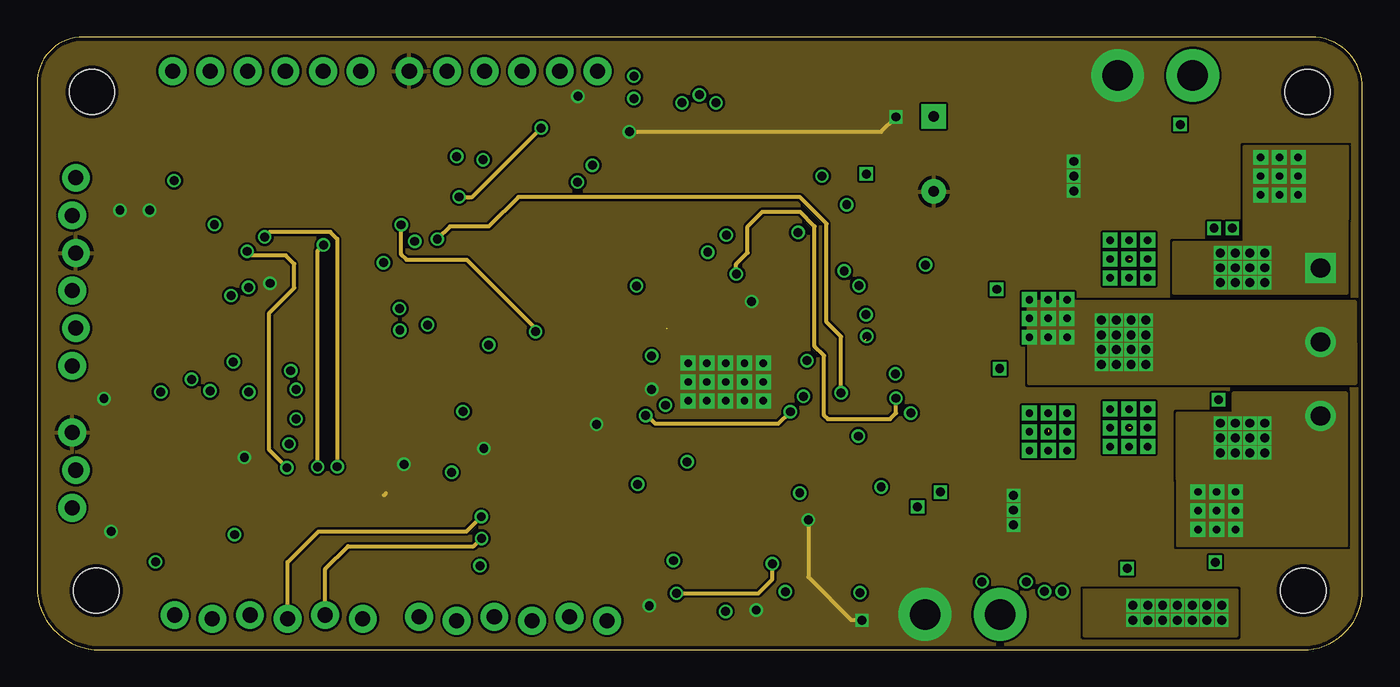
[diagram p8: board, inner layer Route15]
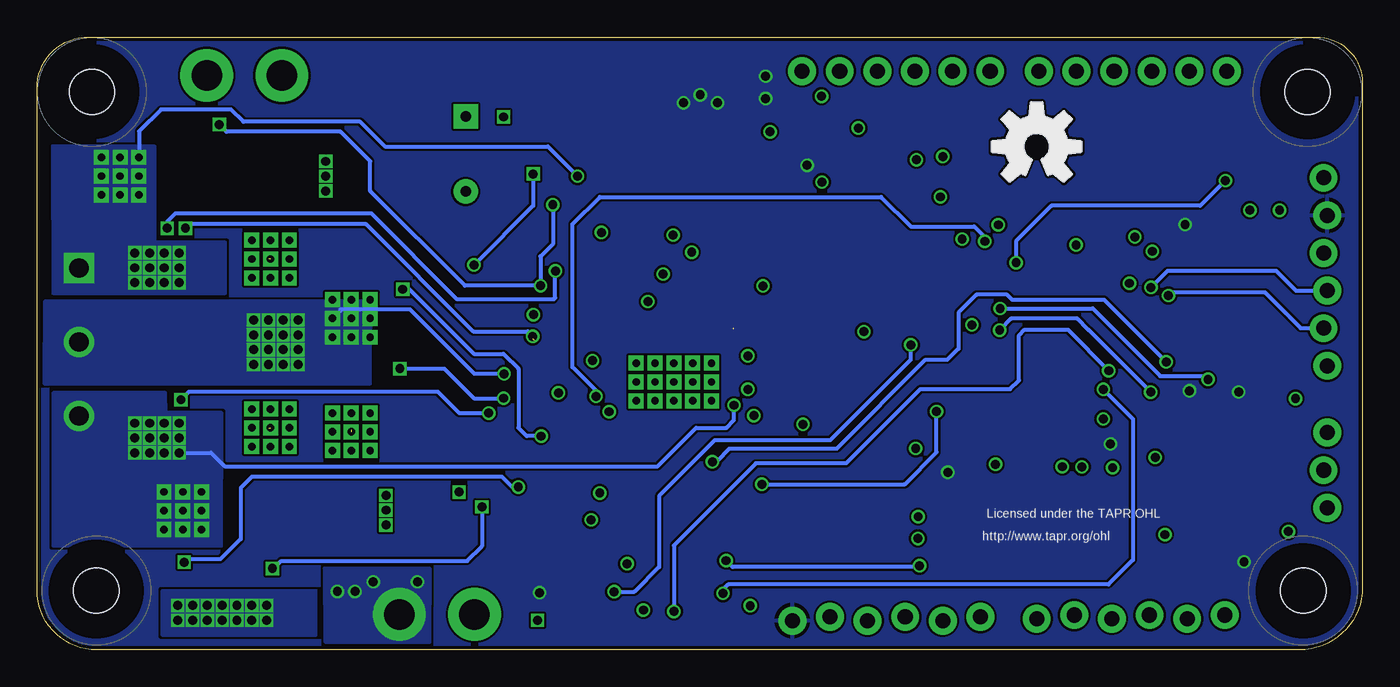
[diagram p9: board, bottom side, seen from below]

Size 89.5 x 41.4 mm. Coordinates in mm from the lower left corner, seen from the top.
Outline: 0,38.28 0,4.24 arc90 4.24,0 85.47,0 arc90 89.5,4.03 89.5,37.93 arc90 86.03,41.4 3.12,41.4 arc90 0,38.28
Copper layers (1+2*15+16): Top 0.035mm / dielectric 1.5mm / Route2 0.035mm / dielectric 0.15mm / Route15 0.035mm / dielectric 0.2mm / Bottom 0.035mm
Design rules: minimum track width 6mil, minimum drill 12mil, track to track 6mil, track to pad 6mil, pad to pad 6mil, via to via 6mil, smd to smd 0mil, copper to edge 10mil, drill to drill 10mil, minimum pad ring 10mil, minimum via ring 6mil, stop-mask expansion 2mil, vias tented up to drill 100mil, thermal gap 10mil

### Footprints (pad centres in the part's own frame; a part is rotated, then mirrored left to right if it is on the bottom)
0805 = smd 0.8 x 1.2: 1 -0.9,0; 2 0.9,0
1206 = smd 1.6 x 1.8: 1 -1.4,0; 2 1.4,0
CPOL-RADIAL-1000UF-25V = drill 0.7 pad 1.651 square: 1 2.54,0 | drill 0.7 pad 1.651: 2 -2.54,0
SMA-DIODE = smd 1.27 x 1.47: A -2.15,0; C 2.15,0
STAND-OFF-TIGHT = hole 3.048: 0,0
LED-1206 = smd 1.2 x 1.4: A -1.5,0; C 1.5,0
1X02_XTRA_BIG = drill 2.057 pad 3.556: 1 -2.54,0; 2 2.54,0
1X06 = drill 1.016 pad 1.88: 1 -6.35,0; 2 -3.81,0; 3 -1.27,0; 4 1.27,0; 5 3.81,0; 6 6.35,0
1X06_LOCK = drill 1.016 pad 1.88: 1 0,0.127; 2 2.54,-0.127; 3 5.08,0.127; 4 7.62,-0.127; 5 10.16,0.127; 6 12.7,-0.127
1X03_LOCK = drill 1.016 pad 1.88: 1 0,0.127; 2 2.54,-0.127; 3 5.08,0.127
SCREWTERMINAL-5MM-3 = drill 1.3 pad 2.032 square: 1 0,0 | drill 1.3 pad 2.032: 2 5,0; 3 10,0
1X06-SIP_LOCK = drill 1.016 pad 1.88: 1 0,0; 2 2.54,-0.254; 3 5.08,0; 4 7.62,-0.254; 5 10.16,0; 6 12.7,-0.254
MSS6132 = smd 0.25 x 0.25: P$1 2.69,0.02; P$2 -2.73,-0.02
LED-0805 = smd 0.8 x 1.2: 1 -0.9,0; 2 0.9,0
SMT-REF = smd 3.505 x 5.08: 1 2.134,0; 2 -2.007,0
EXB-38V271JV = smd 0.5 x 1: P$1 0,0; P$2 0.8,0; P$3 1.6,0; P$4 2.4,0; P$5 2.4,1.4; P$6 1.6,1.4; P$7 0.8,1.4; P$8 0,1.4
SJ = smd 1.168 x 1.6: 1 -0.762,0; 2 0.762,0
DGK8 = smd 1.422 x 0.432: 1 -2.184,0.965; 2 -2.184,0.33; 3 -2.184,-0.33; 4 -2.184,-0.965; 5 2.184,-0.965; 6 2.184,-0.33; 7 2.184,0.33; 8 2.184,0.965
D8 = smd 1.981 x 0.559: 1 -2.464,1.905; 2 -2.464,0.635; 3 -2.464,-0.635; 4 -2.464,-1.905; 5 2.464,-1.905; 6 2.464,-0.635; 7 2.464,0.635; 8 2.464,1.905
PW16 = smd 1.676 x 0.356: 1 -2.819,2.286; 2 -2.819,1.626; 3 -2.819,0.965; 4 -2.819,0.33; 5 -2.819,-0.33; 6 -2.819,-0.965; 7 -2.819,-1.626; 8 -2.819,-2.286; 9 2.819,-2.286; 10 2.819,-1.626; 11 2.819,-0.965; 12 2.819,-0.33; 13 2.819,0.33; 14 2.819,0.965; 15 2.819,1.626; 16 2.819,2.286
QFP64-10X10MC = smd 1.473 x 0.279: 1 -5.613,3.759; 2 -5.613,3.251; 3 -5.613,2.743; 4 -5.613,2.261; 5 -5.613,1.753; 6 -5.613,1.245; 7 -5.613,0.762; 8 -5.613,0.254; 9 -5.613,-0.254; 10 -5.613,-0.762; 11 -5.613,-1.245; 12 -5.613,-1.753; 13 -5.613,-2.261; 14 -5.613,-2.743; 15 -5.613,-3.251; 16 -5.613,-3.759; 33 5.613,-3.759; 34 5.613,-3.251; 35 5.613,-2.743; 36 5.613,-2.261; 37 5.613,-1.753; 38 5.613,-1.245; 39 5.613,-0.762; 40 5.613,-0.254; 41 5.613,0.254; 42 5.613,0.762; 43 5.613,1.245; 44 5.613,1.753; 45 5.613,2.261; 46 5.613,2.743; 47 5.613,3.251; 48 5.613,3.759 | smd 0.279 x 1.473: 17 -3.759,-5.613; 18 -3.251,-5.613; 19 -2.743,-5.613; 20 -2.261,-5.613; 21 -1.753,-5.613; 22 -1.245,-5.613; 23 -0.762,-5.613; 24 -0.254,-5.613; 25 0.254,-5.613; 26 0.762,-5.613; 27 1.245,-5.613; 28 1.753,-5.613; 29 2.261,-5.613; 30 2.743,-5.613; 31 3.251,-5.613; 32 3.759,-5.613; 49 3.759,5.613; 50 3.251,5.613; 51 2.743,5.613; 52 2.261,5.613; 53 1.753,5.613; 54 1.245,5.613; 55 0.762,5.613; 56 0.254,5.613; 57 -0.254,5.613; 58 -0.762,5.613; 59 -1.245,5.613; 60 -1.753,5.613; 61 -2.261,5.613; 62 -2.743,5.613; 63 -3.251,5.613; 64 -3.759,5.613
DCA56_6P35X3P600 = smd 1.168 x 0.305: 1 -3.759,6.756; 2 -3.759,6.248; 3 -3.759,5.74; 4 -3.759,5.258; 5 -3.759,4.75; 6 -3.759,4.242; 7 -3.759,3.759; 8 -3.759,3.251; 9 -3.759,2.743; 10 -3.759,2.261; 11 -3.759,1.753; 12 -3.759,1.245; 13 -3.759,0.762; 14 -3.759,0.254; 15 -3.759,-0.254; 16 -3.759,-0.762; 17 -3.759,-1.245; 18 -3.759,-1.753; 19 -3.759,-2.261; 20 -3.759,-2.743; 21 -3.759,-3.251; 22 -3.759,-3.759; 23 -3.759,-4.242; 24 -3.759,-4.75; 25 -3.759,-5.258; 26 -3.759,-5.74; 27 -3.759,-6.248; 28 -3.759,-6.756; 29 3.759,-6.756; 30 3.759,-6.248; 31 3.759,-5.74; 32 3.759,-5.258; 33 3.759,-4.75; 34 3.759,-4.242; 35 3.759,-3.759; 36 3.759,-3.251; 37 3.759,-2.743; 38 3.759,-2.261; 39 3.759,-1.753; 40 3.759,-1.245; 41 3.759,-0.762; 42 3.759,-0.254; 43 3.759,0.254; 44 3.759,0.762; 45 3.759,1.245; 46 3.759,1.753; 47 3.759,2.261; 48 3.759,2.743; 49 3.759,3.251; 50 3.759,3.759; 51 3.759,4.242; 52 3.759,4.75; 53 3.759,5.258; 54 3.759,5.74; 55 3.759,6.248; 56 3.759,6.756 | smd 3.607 x 6.35: 57 0,0 | drill 0.5 square: P$1 -1.27,2.54; P$2 1.27,2.54; P$3 0,2.54; P$4 0,1.27; P$5 -1.27,1.27; P$6 1.27,1.27; P$7 1.27,0; P$8 0,0; P$9 -1.27,0; P$10 -1.27,-1.27; P$11 0,-1.27; P$12 1.27,-1.27; P$13 1.27,-2.54; P$14 0,-2.54; P$15 -1.27,-2.54
TO127P600X120-5N = smd 1.65 x 0.6: 1 -2.65,1.905; 2 -2.65,0.635; 3 -2.65,-0.635; 4 -2.65,-1.905 | smd 4.6 x 4.5: 5 1.15,0 | drill 0.5 square: P$1 0,1.27; P$2 1.27,1.27; P$3 2.54,1.27; P$4 2.54,0; P$5 1.27,0; P$6 0,0; P$7 0,-1.27; P$8 1.27,-1.27; P$9 2.54,-1.27

### Placement (x,y rotation side)
C1  63.78,39.55 180 top
C2  68,39.31 0 top
C3  58.27,5.82 180 top
C4  58.3,7.56 180 top
C5  40.42,27.22 90 top
C6  41.56,32.4 0 top
C7  11.88,32.6 270 top
C8  51.43,38.37 0 top
C9  46.02,31.1 90 top
C10  48.25,31.1 90 top
C11  50.5,31.1 90 top
C12  57.42,9.54 180 top
C13  80.48,35.49 0 top
C14  37.5,8.9 90 top
C15  36.23,6.01 180 top
C16  47.59,6.42 270 top
C17  47.73,9.86 0 top
C18  52.82,7.23 0 top
C19  56.12,18.15 270 top
C20  35.81,13.14 270 top
C21  32.84,18.5 90 top
C22  6.97,26.84 0 top
C23  22.74,37 180 top
C24  30.92,36.05 180 top
C25  32.74,26.77 270 top
C26  7.54,16.04 180 top
C27  60.55,33.51 90 top
C28  57.6,39.78 0 top
C29  17,7 270 top
C30  16.48,9.68 180 top
C31  8,8 90 top
D1  51.97,34.85 180 top
E$1  [STAND-OFF-TIGHT]  3.7,37.7 0 top
E$2  [STAND-OFF-TIGHT]  4,4 0 top
E$3  [STAND-OFF-TIGHT]  85.5,4 0 top
E$4  [STAND-OFF-TIGHT]  85.8,37.7 0 top
F1  70.24,2.06 180 top
J1  62.5,2.4 0 top
J2  75.5,38.8 0 top
JP1  15.5,39.1 180 top
JP2  31.49,39.1 180 top
JP3  2.5,31.89 270 top
JP5  38.5,2.1 180 top
JP6  2.5,9.6 90 top
JP7  86.67,25.8 270 top
JP8  22,2.1 180 top
L1  44.71,36.68 270 top
LED1  6.95,23.8 180 top
LED2  6.95,22.17 180 top
LED3  6.95,20.67 180 top
LED4  6.95,19.17 180 top
R3  44.05,31.1 90 top
R4  74.86,31.97 180 top
R5  7.5,32.6 90 top
R6  14.1,32.6 90 top
R7  70.66,9.57 180 top
R8  35.43,17.23 90 top
R9  35.5,8.91 270 top
R10  41.76,8.92 270 top
R11  39.45,8.92 90 top
R12  27,14.77 270 top
R13  22.35,14.78 270 top
R14  20.06,14.76 270 top
R15  52.84,5.61 180 top
R16  52.84,3.96 0 top
R17  7.45,13.63 0 top
R18  34.49,32.83 180 top
R19  35.63,35.32 90 top
R20  55.12,38.46 270 top
RN1  10.95,20.2 90 top
SJ1  36.5,20.02 180 top
SJ4  36.5,22.28 180 top
SJ5  36.5,24.58 180 top
SJ6  36.5,26.88 180 top
SJ7  36.5,29.2 180 top
SJ8  7.31,11.42 0 top
U1  13,7 0 top
U2  12.33,12.94 270 top
U3  24.33,8.65 180 top
U$1  22.98,24.6 180 top
U$2  46.5,18.1 90 top
U$3  75,15 180 top
U$4  68.28,16 270 top
U$5  75,26.4 180 top
U$6  78.39,9.4 0 top
U$7  68.28,23.66 270 top
U$8  82.62,32 0 top

### Tracks (layer width: path | path; a pad name or v marks a point on that pad's centre or on a via)
AN4  (via drill 0.6 pad 0.25)
  Top 0.254: U$1.17 26.74,31.47 27.44,32.17 29.18,32.17 v30.12,33.11
  Route2 0.254: JP5.4 32.5,3.85 32.5,30.73 v30.12,33.11
AN5  (via drill 0.6 pad 0.25)
  Top 0.254: v28.34,33.33 27.75,33.33 26.24,31.82 26.24,30.22 U$1.18
  Route2 0.254: JP5.5 31.5,5.13 31.5,30.17 v28.34,33.33
CAN_H
  Top 0.254: U2.7 12.96,12.95 12.43,13.48 8.5,13.48 R17.2 8.35,14.58 8.17,14.76 5.57,14.76 5,14.19 5,13 4.14,12.14 JP6.2
CAN_L
  Top 0.254: U2.6 11.7,11.74 11.25,12.19 8.84,12.19 SJ8.2 | 8,11.35 SJ8.2 | JP6.1 5.6,9.6 6,10 7.68,10 8.08,10.4 SJ8.2
CANRX  (via drill 0.6 pad 0.25)
  Top 0.254: U$1.58 23.74,20.98 23.65,21.07 23.65,22.23 24.21,22.79 24.21,22.8 v24.47,23.06 | v10.43,18.28 U2.4
  Bottom 0.254: v24.47,23.06 18.21,23.06 13.65,18.5 10.65,18.5 v10.43,18.28
CANTX  (via drill 0.6 pad 0.25)
  Top 0.254: U$1.59 24.23,21.32 v24.5,21.6 | U2.1 14.3,15.47 v14.3,17.41
  Bottom 0.254: v24.5,21.6 23.73,22.37 19.26,22.37 18.5,21.61 18.5,21.6 18.49,21.6 v14.3,17.41
CRNT1  (via drill 0.6 pad 0.25)
  Top 0.254: U$1.13 26.24,26.86 v25.5,27.6 | U$2.25 v51.76,17.12 v51.75,17.13
  Bottom 0.254: 25.5,27.9 v25.5,27.6 25.5,27.89 26.21,28.6 30.5,28.6 32.5,30.6 51.5,30.6 53.35,28.75 53.35,19.11 51.75,17.51 v51.75,17.13
CRNT2  (via drill 0.6 pad 0.25)
  Top 0.254: U$1.14 27.44,27.34 v27.03,27.75 | U$2.26 52.24,16.04 53.67,17.47 54.18,17.47 v54.29,17.36
  Route15 0.254: v54.29,17.36 54.29,21.16 53.31,22.14 53.31,28.79 51.5,30.6 32.5,30.6 30.5,28.6 27.88,28.6 v27.03,27.75
DC_CAL  (via drill 0.6 pad 0.25)
  Top 0.254: v17.13,18.86 19.09,18.86 U$1.49 | v46.5,2.6 45.7,2.6 45.26,3.04 U$2.12
  Bottom 0.254: v17.13,18.86 v17.12,18.85 17.11,18.85 19.89,21.63 22.82,21.63 23.2,21.25 23.2,18.21 23.8,17.61 29.86,17.61 34.87,12.6 40.96,12.6 46.5,7.06 v46.5,2.6
EN_A  (via drill 0.6)
  Top 0.254: U3.15 19.73,7.02 18.56,8.19 18.56,10.62 v16.87,12.31 | v14.19,26.92 14.19,26.9 14.23,26.86 U$1.36
  Route15 0.254: v16.87,12.31 15.68,13.5 15.68,22.76 17.37,24.45 17.37,26.07 16.79,26.65 14.46,26.65 v14.19,26.92
EN_A+  (via drill 0.6)
  Top 0.254: v30.02,7.53 29.5,7.01 27.16,7.01 U3.2
  Route15 0.254: JP8.2 19.46,5.46 21,7 29.49,7 v30.02,7.53
EN_A-
  Top 0.254: JP8.1 22.79,2 U3.1
EN_B  (via drill 0.6)
  Top 0.254: U3.14 20.02,7.68 19.34,8.36 19.34,11.43 18.95,11.82 v18.95,12.36 | v19.34,27.35 U$1.35
  Route15 0.254: v18.95,12.36 18.95,26.96 v19.34,27.35
EN_B+  (via drill 0.6)
  Top 0.254: v30,9 28.69,7.69 U3.3
  Route15 0.254: JP8.3 16.92,5.92 19,8 29,8 v30,9
EN_B-
  Top 0.254: U3.4 25.36,8.32 25.15,8.11 25.15,6.45 22.64,3.94 16.07,3.94 JP8.4
EN_C  (via drill 0.6)
  Top 0.254: U3.11 20.52,9.62 20.29,9.84 20.29,12.38 v20.27,12.38 | U$1.34 15.41,27.85 v15.37,27.89
  Route15 0.254: v20.27,12.38 20.27,27.76 19.8,28.23 15.71,28.23 v15.37,27.89
EN_C+
  Top 0.254: JP8.6 9.3,3.3 11,5 22.12,5 24,6.88 24,8.63 24.97,9.62 U3.6
EN_C-
  Top 0.254: U3.5 25.25,8.98 24.64,8.37 24.64,6.71 22.41,4.48 12.4,4.48 11.84,3.92 JP8.5
EN_GATE  (via drill 0.6 pad 0.25)
  Top 0.254: U$1.50 19.73,17.83 19.5,17.6 v17.5,17.6 | U$2.16 47.26,12.02 47.59,11.69 48.52,11.69 49.75,10.46 49.75,5.92 v49.65,5.82
  Route15 0.254: v49.65,5.82 49.65,4.77 48.7,3.82 v43.18,3.82
  Bottom 0.254: v17.5,17.6 15.5,15.6 15.5,6.07 17.15,4.42 42.84,4.42 43.18,4.08 v43.18,3.82
FAULT  (via drill 0.6 pad 0.25)
  Top 0.254: U$1.52 20.72,16.32 R14.1 17.56,15.66 v17.5,15.6 | U$2.6 42.26,11.88 43.43,10.71 43.43,6.5 v42.97,6.03
  Route2 0.254: v29.91,5.69 20.31,5.69 16,10 16,14.94 16.66,15.6 v17.5,15.6
  Bottom 0.254: v29.91,5.69 30,5.6 42.53,5.6 v42.97,6.03
GAIN  (via drill 0.6 pad 0.25)
  Top 0.254: U$2.10 44.24,13.04 v43.91,12.71 v43.9,12.71 | U$1.51 20.24,16.98 19.86,16.6 16.58,16.6 14.45,18.73 13.98,18.73 v13.25,19.46
  Bottom 0.254: v13.25,19.46 17.45,23.66 23.66,23.66 24,24 26.06,24 27.28,22.78 27.28,20.35 28.03,19.6 29.5,19.6 35.5,13.6 42.74,13.6 43.63,12.71 v43.9,12.71
GH_A  (via drill 0.6 pad 0.25)
  Top 0.254: v79.78,16.9 U$3.4 | U$2.47 44.24,21.09 44.12,20.9 41.79,20.9 41.5,20.68 v41.5,19.86
  Route2 0.254: v59,16 59.02,38.99 58,40 44,40 41.5,37.5 v41.5,19.86
  Bottom 0.254: v79.78,16.9 79.24,17.44 62.44,17.44 61,16 v59,16
GH_B  (via drill 0.6 pad 0.25)
  Top 0.254: U$2.42 46.75,24.92 v47.22,25.39 | v65,19 66.03,19 U$4.4
  Route15 0.254: v47.22,25.39 47.21,26.06 47.98,26.83 47.98,28.61 48.97,29.6 51.5,29.6 52.5,28.6 52.5,20.51 53.14,19.87 53.14,15.85 53.39,15.6 57.6,15.6 58,16 v58,17
  Bottom 0.254: v65,19 62,19 60,17 v58,17
GH_C  (via drill 0.6 pad 0.25)  (1 unrouted)
  Top 0.254: U$2.37 49.24,21.02 49.36,20.9 55.9,20.9 | v79.48,28.48 77.83,28.48 U$5.4 | 56,21 56,21.15 v56.03,21.18
  Bottom 0.254: v79.48,28.48 79.21,28.75 67.28,28.75 60.04,21.51 56.36,21.51 v56.03,21.18
GL_A  (via drill 0.6 pad 0.25)
  Top 0.254: U$2.45 45.26,26.82 v45.29,26.86 | U$6.4 77.23,6 79.48,6 v79.56,5.92
  Route2 0.254: v45.29,26.86 45.26,26.89 45.26,29.36 47,31.1 47,37 49,39 56,39 56.98,38.02 v57,11
  Bottom 0.254: v57,11 57.41,11 58.12,11.71 74.97,11.71 75.74,10.94 U$6.4 77.12,6.12 79.36,6.12 v79.56,5.92
GL_B  (via drill 0.6 pad 0.25)
  Top 0.254: U$2.40 47.74,21.36 | 47.75,21.35 47.74,21.36 | v51.99,19.54 51.05,20.44 48.06,20.44 47.74,20.8 47.74,21.36 | U$7.4 64.81,24.75 v64.81,24.36
  Route2 0.254: v51.99,19.54 55.46,19.54 56,19 56,14.98 v55.46,14.44
  Bottom 0.254: v55.46,14.44 56.44,14.44 57,15 57,19 58,20 60,20 64.36,24.36 v64.81,24.36
GL_C  (via drill 0.6 pad 0.25)
  Top 0.254: U$2.35 50.26,27.4 51.06,28.2 v51.39,28.2 | v80.71,28.48 80.71,29.36 U$8.4
  Route2 0.254: v51.39,28.2 51.9,28.2 52.5,27.6 52.5,26.6 53.5,25.6 v54.5,25.6
  Bottom 0.254: v80.71,28.48 80.71,28.93 80.15,29.49 66.93,29.49 61.12,23.68 54.62,23.68 54.51,23.79 v54.51,25.59 v54.5,25.6
GND  (via drill 0.6, 0.6 pad 0.25)
  Top 0.254: U$1.41 16.43,24.35 | 16.43,24.35 16.42,24.34 | 16.43,24.35 16.24,24.35 v15.73,24.76 | U$2.7 42.74,15.22 42.83,15.31 43.63,15.31 | 43.63,15.31 43.76,15.18 U$2.9 | 43.63,15.31 43.63,16.8 U$2.P$9 | U$2.28 53.76,14.34 54.5,13.6 | C19.1 56.15,19.02 | 54.5,34.47 D1.A | U$2.39 48.25,23.37 v48.25,23.53 | R3.2 44.06,32.66 44.47,33.07 48.54,33.07 49.07,33.6 50.84,33.6 52,34.76 52,35 53,36 v58,36 | U$2.32 51.76,24.86 54.95,28.05 55.95,28.05 56.78,27.22 56.78,24.07 56.2,23.49 55.43,23.49 54.94,23 53,23 52.75,22.75 U$2.30 52.75,22.85 | C18.1 52.08,7.23 v52.08,8.78 | R16.2 53.74,3.26 55,2 v55.7,2 | R8.2 35.26,18.13 34.51,18.88 34.51,18.99 34.09,19.41 C21.2 | U3.12 22.48,8.98 23.06,9.56 23.06,10.07 23.43,10.44 | U3.9 22.62,10.94 23.59,11.9 | U1.4 10.35,5.57 9.55,5.57 | U1.5 15.15,6 14,6
  Top 0.406: C12.2 56.52,7.94 C4.2
  Route15 0.254: v48.25,23.53 48.25,23.44 | v40,35 57,35 v58,36 | v52.08,8.78 52.08,4.92 55,2 v55.7,2 | 23.43,10.44 23.57,10.58
  other vias: 41.34,2.99 48.56,2.69 37.78,15.24 36.52,37.39 4.52,16.98 5.6,29.7 7.6,29.7 30.17,13.61 41.5,17.6 70,33 70,32 70,31 65.94,10.44 65.94,9.44 65.94,8.44 5,8 14,13 24.78,12.54
  pour Top (rank 2): 0,41.4 0,0 89.5,0 89.55,41.4
  pour Route15 (rank 2): 0,41.4 89.61,41.4 89.5,0 0,0
MCLR  (via drill 0.6 pad 0.25)
  Top 0.254: JP3.1 7.31,31.89 R5.1 v9.25,31.7 | U$1.7 27.26,23.84 26.5,24.6 26.5,25.2 26.52,25.22 26.14,25.6 23.95,25.6 v23.39,26.16
  Bottom 0.254: v9.25,31.7 10.95,30 21,30 23.39,27.61 v23.39,26.16
N$1
  Top 0.254: U$2.56 39.45,22.15 39.45,25.55 40.22,26.32 C5.1
N$2
  Top 0.254: R5.2 C7.1 R6.2
N$3
  Bottom 0.2: 22.79,32.09 arc9 23.09,32.25 23.85,31.64 24.36,32.15 23.75,32.91 arc19 24.01,33.54 24.98,33.63 24.98,34.37 24.01,34.46 arc19 23.75,35.09 24.36,35.85 23.85,36.36 23.09,35.75 arc19 22.46,36.01 22.37,36.98 21.63,36.98 21.54,36.01 arc19 20.91,35.75 20.15,36.36 19.64,35.85 20.25,35.09 arc19 19.99,34.46 19.02,34.37 19.02,33.63 19.99,33.54 arc19 20.25,32.91 19.64,32.15 20.15,31.64 20.91,32.25 arc9 21.21,32.09 21.64,33.13 arc-68 21.06,34 arc-248 22.36,33.13 22.79,32.09
N$4
  Top 0.254: C6.1 40.67,29.83 41.75,28.75 U$2.52
N$6
  Top 0.254: C28.1 55.54,39.78 R20.1
N$7
  Top 0.254: U$2.49 43.25,29.65 43.8,30.2 R3.1
N$8
  Top 0.254: U$2.48 43.76,27.94 C9.1
N$9
  Top 0.254: C10.1 48.25,29.61 47.39,28.75 47.39,26.83 46.26,25.7 46.26,21.87 U$2.43
N$10
  Top 0.254: C11.1 50.5,29.6 49.23,28.33 49.23,23.08 48.76,22.61 U$2.38
N$11
  Top 0.254: U$1.3 31.1,21.86 32.51,20.45 35.31,20.45 SJ1.2
N$13
  Top 0.254: U1.6 16.43,6.67 C29.2
N$14
  Top 0.254: R8.1 39.1,16.33 39.74,15.69 U$2.1
N$15
  Top 0.254: R9.2 35.5,6.18 C15.2
N$16
  Top 0.254: 37.12,9.81 C14.2 | C14.2 37.5,11.35 37.91,11.76 38.77,11.76 40.25,13.24 U$2.2 | R9.1 C14.2
N$17
  Top 0.254: R10.1 R11.2 39.5,9.87 39.5,11.6 40.76,12.86 U$2.3
N$18
  Top 0.254: U$2.13 45.74,8.67 46.59,7.82 C16.1
N$19
  Top 0.254: U$2.14 46.25,10.44 C17.1
N$20
  Top 0.254: U$2.15 46.75,11.3 47.02,11.03 48.23,11.03 48.63,10.63 C17.2
N$21
  Top 0.254: U$2.23 50.74,12.88 53.5,10.12 53.5,7.17 C18.2 53.74,6.93 R15.1
N$22
  Top 0.254: U$2.27 52.75,15.22 53.67,16.14 55.04,16.14 56.12,17.22 C19.2
N$23
  Top 0.254: U1.7 16.43,7.33 C29.1
N$24
  Top 0.254: U$2.11 44.75,2.35 45.5,1.6 51.12,1.6 51.89,2.37 51.89,3.91 R16.1 | R16.1 | R15.2 R16.1
N$25
  Top 0.254: U$1.15 29.65,27.85 30.26,28.46 30.26,28.47 33.45,31.66 33.45,32.69 R18.2 | 33.36,32.6 R18.2 | R18.2 33.59,33.57 34.32,34.3 35.51,34.3 R19.1
N$27
  Top 0.254: U$1.4 35.68,22.34 SJ4.2
N$28
  Top 0.254: U$1.5 33.27,22.85 34.98,24.56 35.72,24.56 SJ5.2
N$29
  Top 0.254: U$1.6 32.92,23.36 34.51,24.94 34.51,26.36 35.03,26.88 SJ6.2
N$30
  Top 0.254: U$1.8 32.97,24.35 33.86,25.24 33.86,28.16 34.9,29.2 SJ7.2
N$31
  Top 0.254: U$1.56 22.73,17.29 22.95,17.07 31.28,17.07 33.81,14.54 C20.1
N$32
  Top 0.254: U$1.57 23.23,17.76 23.39,17.6 C21.1
N$33
  Top 0.254: U$1.48 13.23,20.84 12.59,20.2 RN1.P$1
N$34
  Top 0.254: U$1.38 8.87,25.84 C22.2
N$35
  Top 0.254: U$1.10 30.47,25.36 31.86,26.75 31.86,26.79 C25.1
N$36
  Top 0.254: U$1.9 31.72,24.85 C25.2
N$37
  Top 0.254: U$1.20 25.24,32.34 28.5,35.6 29.57,35.6 C24.2
N$38
  Top 0.254: U$1.19 25.72,32.07 28.25,34.6 31.5,34.6 31.82,34.92 C24.1
N$39
  Top 0.254: U$1.26 22.22,36.62 C23.2
N$40
  Top 0.254: U$1.25 22.73,36.09 C23.1
N$41
  Top 0.254: U$1.47 12.84,21.35 12.49,21 RN1.P$2
N$42
  Top 0.254: U$1.46 11.01,21.86 RN1.P$3
N$43
  Top 0.254: U$1.45 12.76,22.34 12.5,22.6 RN1.P$4
N$44
  Top 0.254: LED1.1 8.35,23.8 RN1.P$5
N$45
  Top 0.254: RN1.P$6 8.22,21.8 LED2.1
N$46
  Top 0.254: RN1.P$7 8.18,21 LED3.1
N$47
  Top 0.254: LED4.1 8.52,19.17 RN1.P$8
N$48
  Top 0.254: U$1.32 19.22,31.1 17.36,32.96 17.36,35.5 16.32,36.54 11.25,36.54 9.15,38.64 JP1.6
N$49
  Top 0.254: U$1.31 19.73,31.34 17.9,33.17 17.9,36.07 16.83,37.14 12.95,37.14 12.5,37.59 12.5,37.6 11.69,38.41 JP1.5
N$50
  Top 0.254: U$1.30 20.24,31.65 18.53,33.36 18.53,36.26 16.99,37.8 15.53,37.8 JP1.4
N$51
  Top 0.254: U$1.29 20.71,30.22 20.71,31.89 19.08,33.52 19.08,36.49 17.2,38.37 17.2,38.38 17,38.58 17,38.87 JP1.3
N$52
  Top 0.254: U$1.28 21.23,32.05 19.63,33.65 19.63,33.82 19.64,38.77 JP1.2
N$53
  Top 0.254: U$1.27 21.73,32.36 20.27,33.83 20.27,37.52 JP1.1
N$55
  Top 0.254: U$1.16 28.76,28.53 28.76,29.32 32.85,33.41 32.85,35.95 35.5,38.6 35.5,38.9 JP2.2
N$56
  Top 0.254: U$1.21 24.73,32.54 29.48,37.29 31.76,37.29 32.77,38.3 JP2.3
N$57
  Top 0.254: U$1.22 24.23,32.98 29.81,38.56 29.81,38.69 JP2.4
N$58
  Top 0.254: U$1.23 23.74,33.32 26.42,36 26.42,37.84 JP2.5
N$64
  Top 0.254: R17.1 SJ8.1
OCTW
  Top 0.254: U$1.53 21.23,16.34 21.66,15.91 22.12,15.91 R13.1 22.86,15.17 25.57,15.17 25.95,14.79 32.31,14.79 33.5,13.6 33.5,9.75 34.32,8.93 42.55,8.93 42.84,9.22 42.84,10.52 41.75,11.61 U$2.5
OUT_U  (via drill 0.6 pad 0.25)
  Top 0.254: C9.2 46.21,32.19 46.9,32.19 47.03,32.06 47.03,29.51 46.67,29.15 46.19,29.15 44.36,27.32 44.36,23.46 44.74,23.08 U$2.46 44.74,20.61 44.58,20.44 42.96,20.43 42.56,20.05 42.56,16.65 v42.44,16.53
  Bottom 0.254: v79.9,13.31 77.75,13.31 76.84,12.4 47.6,12.4 45,15 42.96,15 42.44,15.52 v42.44,16.53
  other vias: 79.9,15.31 80.9,15.31 81.9,15.31 81.9,14.31 82.9,15.31 82.9,14.31 80.9,14.31 79.9,14.31 80.9,13.31 81.9,13.31 82.9,13.31
  pour Route2 (isolate 0.254): 77.03,15.99 80.82,16 80.82,17.34 88.37,17.34 88.39,7.06 77.05,7.05
  pour Bottom (isolate 0.254): 77.04,15.99 80.82,16 80.84,17.34 88.39,17.34 88.39,7.06 77.06,7.05
  pour Top (isolate 0.254): 77.02,15.99 80.82,16 80.83,17.34 88.38,17.34 88.4,7.06 77.05,7.05
  pour Route15 (isolate 0.254): 77.04,15.98 80.82,16 80.82,17.34 88.37,17.34 88.38,7.05 77.05,7.03
OUT_V  (via drill 0.6 pad 0.25)
  Top 0.254: U$2.41 47.26,24.04 48.07,24.85 48.07,28.08 49.5,29.51 49.5,31.84 | C10.2 49.34,32 49.5,31.84 | 49.5,31.84 49.5,32.5 49.85,32.85 52.12,32.85 52.32,33.05 57.88,33.05 58.58,32.35 58.58,19.61 57.96,18.99 v57.96,18.65
  Bottom 0.254: U$7.P$2 69,22.94 69,23 64.31,23 59.96,18.65 v57.96,18.65
  other vias: 72.88,22.28 73.88,22.28 74.88,22.28 74.88,21.28 73.88,21.28 72.88,21.28 72.88,20.28 73.88,20.28 74.88,20.28 74.88,19.28 73.88,19.28 72.88,19.28 71.88,22.28 71.88,21.28 71.88,19.28 71.88,20.28
  pour Top (isolate 0.254): 66.97,23.53 88.97,23.53 89,18 67,18
  pour Route2 (isolate 0.254): 66.97,23.53 88.97,23.53 89,18 67,18
  pour Bottom (isolate 0.254): 66.97,23.53 88.97,23.53 89,18 67,18
  pour Route2 (isolate 0.254): 66.97,23.53 88.97,23.53 89,18 67,18
  pour Route15 (isolate 0.254): 66.97,23.53 88.97,23.53 89,18 67,18
OUT_W  (via drill 0.6 pad 0.25)
  Top 0.254: U$2.36 49.75,27.85 51.89,29.99 51.89,30.89 | 51.89,30.89 51.89,31.75 51.64,32 C11.2 | 51.89,30.89 v53,32
  Bottom 0.254: U$8.P$1 82.61,35.03 81.12,36.5 76.4,36.5 75.55,35.67 67.67,35.67 66,34 55,34 v53,32
  other vias: 79.9,26.81 81.9,26.81 80.9,25.81 79.9,24.81 81.9,24.81 81.9,25.81 80.9,24.81 79.9,25.81 80.9,26.81 82.9,26.81 82.9,25.81 82.9,24.81
  pour Top (isolate 0.254): 76.79,27.51 81.56,27.51 81.55,33.99 88.45,34.01 88.42,24.1 76.79,24.11
  pour Bottom (isolate 0.254): 76.79,27.51 81.56,27.51 81.55,33.99 88.45,34.01 88.42,24.11 76.79,24.12
  pour Route2 (isolate 0.254): 76.79,27.51 81.56,27.51 81.55,33.99 88.45,34.01 88.42,24.11 76.79,24.12
  pour Route15 (isolate 0.254): 76.79,27.51 81.56,27.51 81.55,33.99 88.45,34.01 88.42,24.11 76.78,24.11
PGC  (via drill 0.6 pad 0.25)
  Top 0.254: U$1.44 14.19,22.85 v13.1,23.94
  Bottom 0.254: JP3.5 4.17,21.73 6.57,24.13 12.91,24.13 v13.1,23.94
PGD  (via drill 0.6 pad 0.25)
  Top 0.254: U$1.43 15.41,23.36 v14.28,24.49
  Bottom 0.254: JP3.4 4.5,24.27 5.83,25.6 13.17,25.6 v14.28,24.49
PH1  (1 unrouted)
  Top 0.254: 44.7,34.12 44.57,33.99 | 44.57,33.99 L1.P$1 47.23,33.99 47.23,34.33 | 44.57,33.99 44.5,33.92 42.5,33.92 42.5,32.44 C6.2 | U$2.51 42.32,21.86 42.5,21.68
  Top 0.406: 47.23,34.33 47.75,34.85 D1.C
  Top 0.813: 42.5,34.6 42.5,33.92 42.5,21.73
PVDD  (via drill 0.6, 0.6 pad 0.25)  (3 unrouted)
  Top 0.254: U$2.53 U$2.54 40.76,24.34 v40.48,24.59 | R18.1 35.84,32.83 38.03,35.02 38.03,38.91 JP2.1 | U$2.29 54.93,21.86 v55.98,22.65 | R20.2 59.03,37.56 C27.1 60.6,36.1 62.87,36.1 64.69,37.92 C1.1 | C3.1 59.17,7.03 C4.1 59.7,7.7 61,9 v61,10.66
  Top 0.406: C1.1 66.6,39.55 C2.1
  Route2 0.254: v55.98,22.65 55.98,22.75 | v61,10.66 60.87,10.66 60.86,10.67
  other vias: 80,2 79,2 79,3 80,3 78,2 77,2 76,2 75,2 74,2 74,3 75,3 76,3 77,3 78,3
  pour Route2 (rank 2): 89.56,41.4 89.5,0 0,0 0,41.4
  pour Top (isolate 0.254): 70.72,1 81,1 81,4 70.72,4
  pour Bottom (isolate 0.254): 70.72,1 81,1 81,4 70.72,4
  pour Route15 (isolate 0.254): 70.72,1 81,1 81,4 70.72,4
  pour Route2 (isolate 0.254): 70.72,1 81,1 81,4 70.72,4
PWM1  (via drill 0.6 pad 0.25)
  Top 0.254: U$2.17 47.74,12.46 48,12.2 48.8,12.2 50.56,10.44 50.56,3.96 v50.53,3.93 | U$1.2 29.75,21.35 v30.5,20.6
  Bottom 0.254: v30.5,20.6 30.5,19.6 35.93,14.17 43.73,14.17 47.5,10.4 47.5,5.6 49.17,3.93 v50.53,3.93
PWM3  (via drill 0.6 pad 0.25)
  Top 0.254: U$2.19 48.76,13.41 51.5,10.67 v51.5,10.6 | U$1.62 25.72,20.19 26.37,20.84 v26.37,21.95
  Route2 0.254: v34.04,35.25 36.85,35.25 38.5,33.6 38.5,21.6 39.5,20.6 39.5,18.6 38.99,18.09 38.99,15.02 39.41,14.6 47.5,14.6 v51.5,10.6 | v26.37,21.95 27.85,21.95 28.5,22.6 v28.5,30.6
  Route15 0.254: v28.5,30.6 29.39,30.6 v34.04,35.25
PWM5  (via drill 0.6 pad 0.25)
  Top 0.254: U$1.60 24.73,20.49 25.48,21.24 25.48,22.73 25.91,23.16 26.9,23.16 27.28,22.78 27.28,20.35 27.92,19.71 30.95,19.71 31.21,19.45 31.21,18.91 31.63,18.49 33.92,18.49 34.18,18.23 34.18,17.48 34.44,17.22 36.4,17.22 36.62,17 39.49,17 40.65,15.84 v41.09,15.84 v41.1,15.83 | v50.87,16.09 50.71,16.09 49.75,15.13 U$2.21
  Route15 0.254: v41.1,15.83 41.19,15.83 41.74,15.28 50.06,15.28 v50.87,16.09
PWRGD  (via drill 0.6 pad 0.25)
  Top 0.254: U$1.54 21.73,16.86 22.07,16.52 26.15,16.52 R12.1 27.44,16.11 v28.76,16.11 | U$2.4 41.24,11.87 v40.56,11.19
  Bottom 0.254: v40.56,11.19 30.91,11.19 28.76,13.34 v28.76,16.11
RA11  (via drill 0.6 pad 0.25)
  Top 0.254: U$1.12 25.07,26.35 24.59,26.83 v24.59,28.71
  Route2 0.254: v33.66,21.5 33.66,2.21 JP5.3
  Route15 0.254: v24.59,28.71 24.59,26.72 24.95,26.36 29.01,26.36 33.66,21.71 v33.66,21.5
RA12  (via drill 0.6 pad 0.25)
  Top 0.254: U$1.11 29.75,25.84 30.5,26.6 30.5,27.6 34.5,31.6 v36.5,31.6
  Route2 0.254: v36.5,31.6 36.5,2.77 JP5.2
SN1  (via drill 0.6, 0.6 pad 0.25)
  Top 0.254: 51.25,23.35 U$2.33 51.25,25.35 55.97,30.07 55.97,32.12 v56,32.15 | U$2.44 45.74,26.08 46.4,26.74 46.4,27.87 v46.55,28.02 | 72.67,9 72.67,8.67 71.33,7.33 | 72.67,9 R7.2 | v60,26 60,15 58.39,13.39 58.39,9.66 | 73,8 73,8.67 | 73,8.67 72.67,9 | 58.39,9.66 C12.1 | 58.39,9.66 v59.46,9.66 | v73.61,5.5 73.61,8.06 73,8.67
  Route2 0.254: v46.55,28.02 46.55,29.55 48,31 48,36 50,38 55,38 56,37 v56,32.15
  Bottom 0.254: v56,32.15 56,30 v60,26 | v59.46,9.66 59.46,7 60.46,6 73,6 73.5,5.5 v73.61,5.5
  pour Top (isolate 0.254): 76.39,12.01 71.05,12 71.04,8.56 76.37,8.59
SN2  (via drill 0.6 pad 0.25)
  Top 0.254: U$2.31 52.24,24.34 52.5,24.6 v55.5,24.6 | v77.19,35.49 77.19,35.18 78.91,33.46 79.53,33.46 U$8.1 79.97,35.1 C13.1 | U$2.34 50.74,26.14 v54.67,30.07
  Bottom 0.254: v77.19,35.49 76.7,35 69,35 67,33 67,31 60.6,24.6 v55.5,24.6 55.5,26.58 54.67,27.41 v54.67,30.07
  pour Top (isolate 0.254): 80.9,34.47 75.25,34.46 75.25,31 80.9,30.99
V_IN  (via drill 0.6 pad 0.25)
  other vias: 68.03,3.95 69.22,3.95 66.8,4.6 63.81,4.6
  pour Route2 (isolate 0.254): 69.99,0.51 70.05,5.51 63.02,5.51 63,0.52
  pour Top (isolate 0.254): 70,0.53 70.06,5.51 63.02,5.51 63,0.53
  pour Bottom (isolate 0.254): 70.01,0.53 70.05,5.51 63,5.5 63.01,0.53
VCC3V3  (via drill 0.6, 0.6 pad 0.25)
  Top 0.254: R13.2 | 14.13,31.73 R6.1 14,31.6 14,31 11.98,28.98 v11.98,28.73 | R10.2 41.77,6.93 41.77,5.6 | U$2.8 43.25,13.51 42.94,13.2 42.94,12.31 43.49,11.76 43.83,11.76 44.11,11.48 44.11,5.44 43.68,5.01 42.14,5.01 41.77,5.38 41.77,5.6 | JP5.1 38.5,2.33 41.77,5.6 | U$2.24 51.25,13.53 54.24,10.54 54.24,8.96 55.01,8.19 55.01,4.6 55.57,4.04 v55.57,3.86 | C26.1 8.44,17.34 v8.36,17.42 | v37.5,32.74 37.5,32.16 38.06,31.6 38.06,30 SJ7.1 SJ6.1 SJ5.1 SJ4.1 SJ1.1 | U1.3 U1.2 10.59,7.1 C31.1 v8,5.95 | 22.8,8.32 U3.13 | U3.13 | 22.8,8.32 22.93,8.09 22.92,6.7 22.57,6.36 U3.16 | 22.8,8.32 26,11.59 26,13.88 | 24.68,13.87 24.67,13.88
  Top 0.305: U2.3 11.7,17.48 v11.68,17.5
  Top 0.61: R13.2 16.9,13.88 v17.02,13.91 | R13.2 24.67,13.88 26,13.88 R12.2 v28,12 | R13.2 20.08,13.88 R14.2
  Route2 0.254: v55.57,3.86 55.57,3.67 53.5,1.6 38.86,1.6 JP5.1
  Bottom 0.254: v8.36,17.42 8.31,17.42 8.22,17.51 | v8,5.95 8.19,5.95
  Bottom 0.305: v11.68,17.5 11.68,17.68
  Bottom 0.61: v28,12 28.01,12.03
  other vias: 43.55,36.96 44.72,37.5 45.85,36.96 40.3,37.24 40.3,38.75
  pour Bottom (rank 2): 0,41.4 89.5,41.4 89.5,0 0,0
  pour Top (no thermals): 39.5,41.01 51.5,41.01 51.5,36.6 39.5,36.6
VCC5V  (via drill 0.6)
  Top 0.254: C30.2 15.18,9.28 U1.8 15.15,8 14,8 13.79,7.79 v13.34,7.79
  Route2 0.254: JP5.6 25.06,2.23 22.86,4.43 14.2,4.43 13.36,5.27 13.36,7.77 v13.34,7.79

### Text on the board
tNames: + | GND | V_OUT | PVDD | PMSM Driver Board v1.4 / 6-30 V 40 Amps / (C) - 2013 Pavlo Manovi / http://pavlo.me | ICSP | GND | Motor: W V U | CAN_H | CAN_L | NO SENSITIVE COMPONENTS ABOVE | V_IN | GND | + | C+ | C- | B- | B+ | A+ | A- | 5v | 3.3v
bNames: Licensed under the TAPR OHL | http://www.tapr.org/ohl